# EasyEDA Pro project AiSortArduino.eprj

# Schematic CaseSorter

## Sheets
1 Power
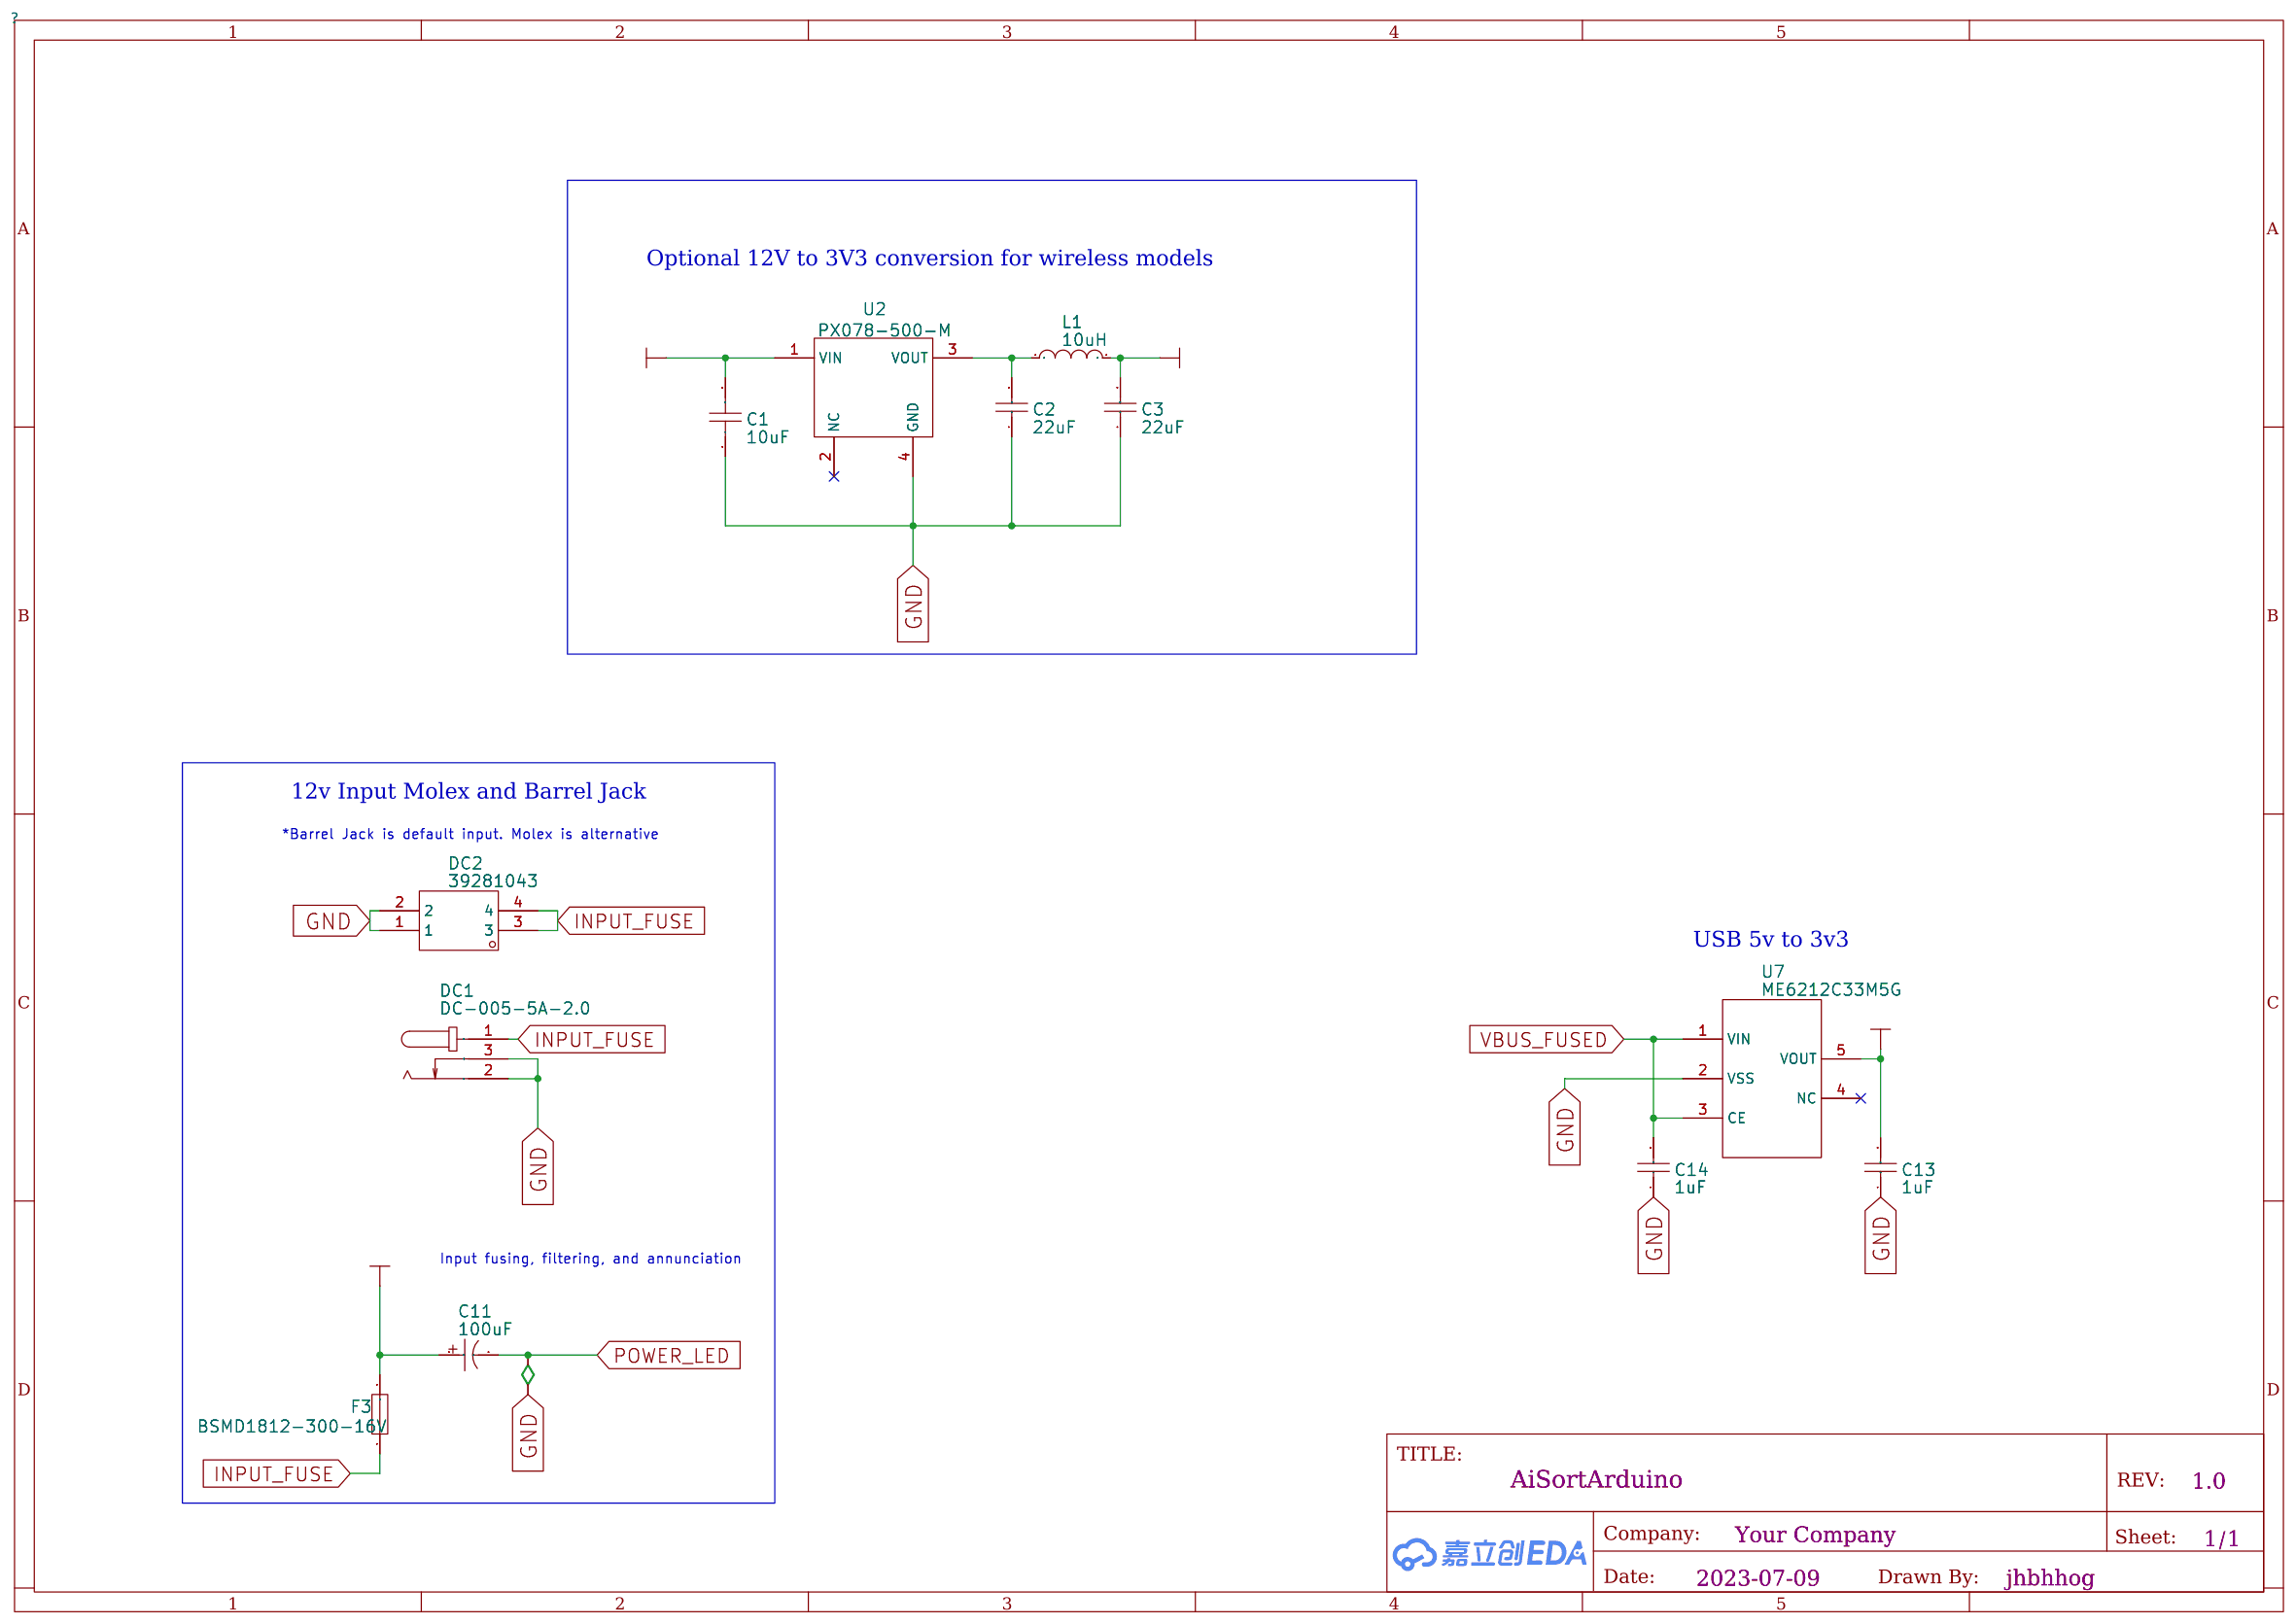
[diagram p0: Power]
2 Motor
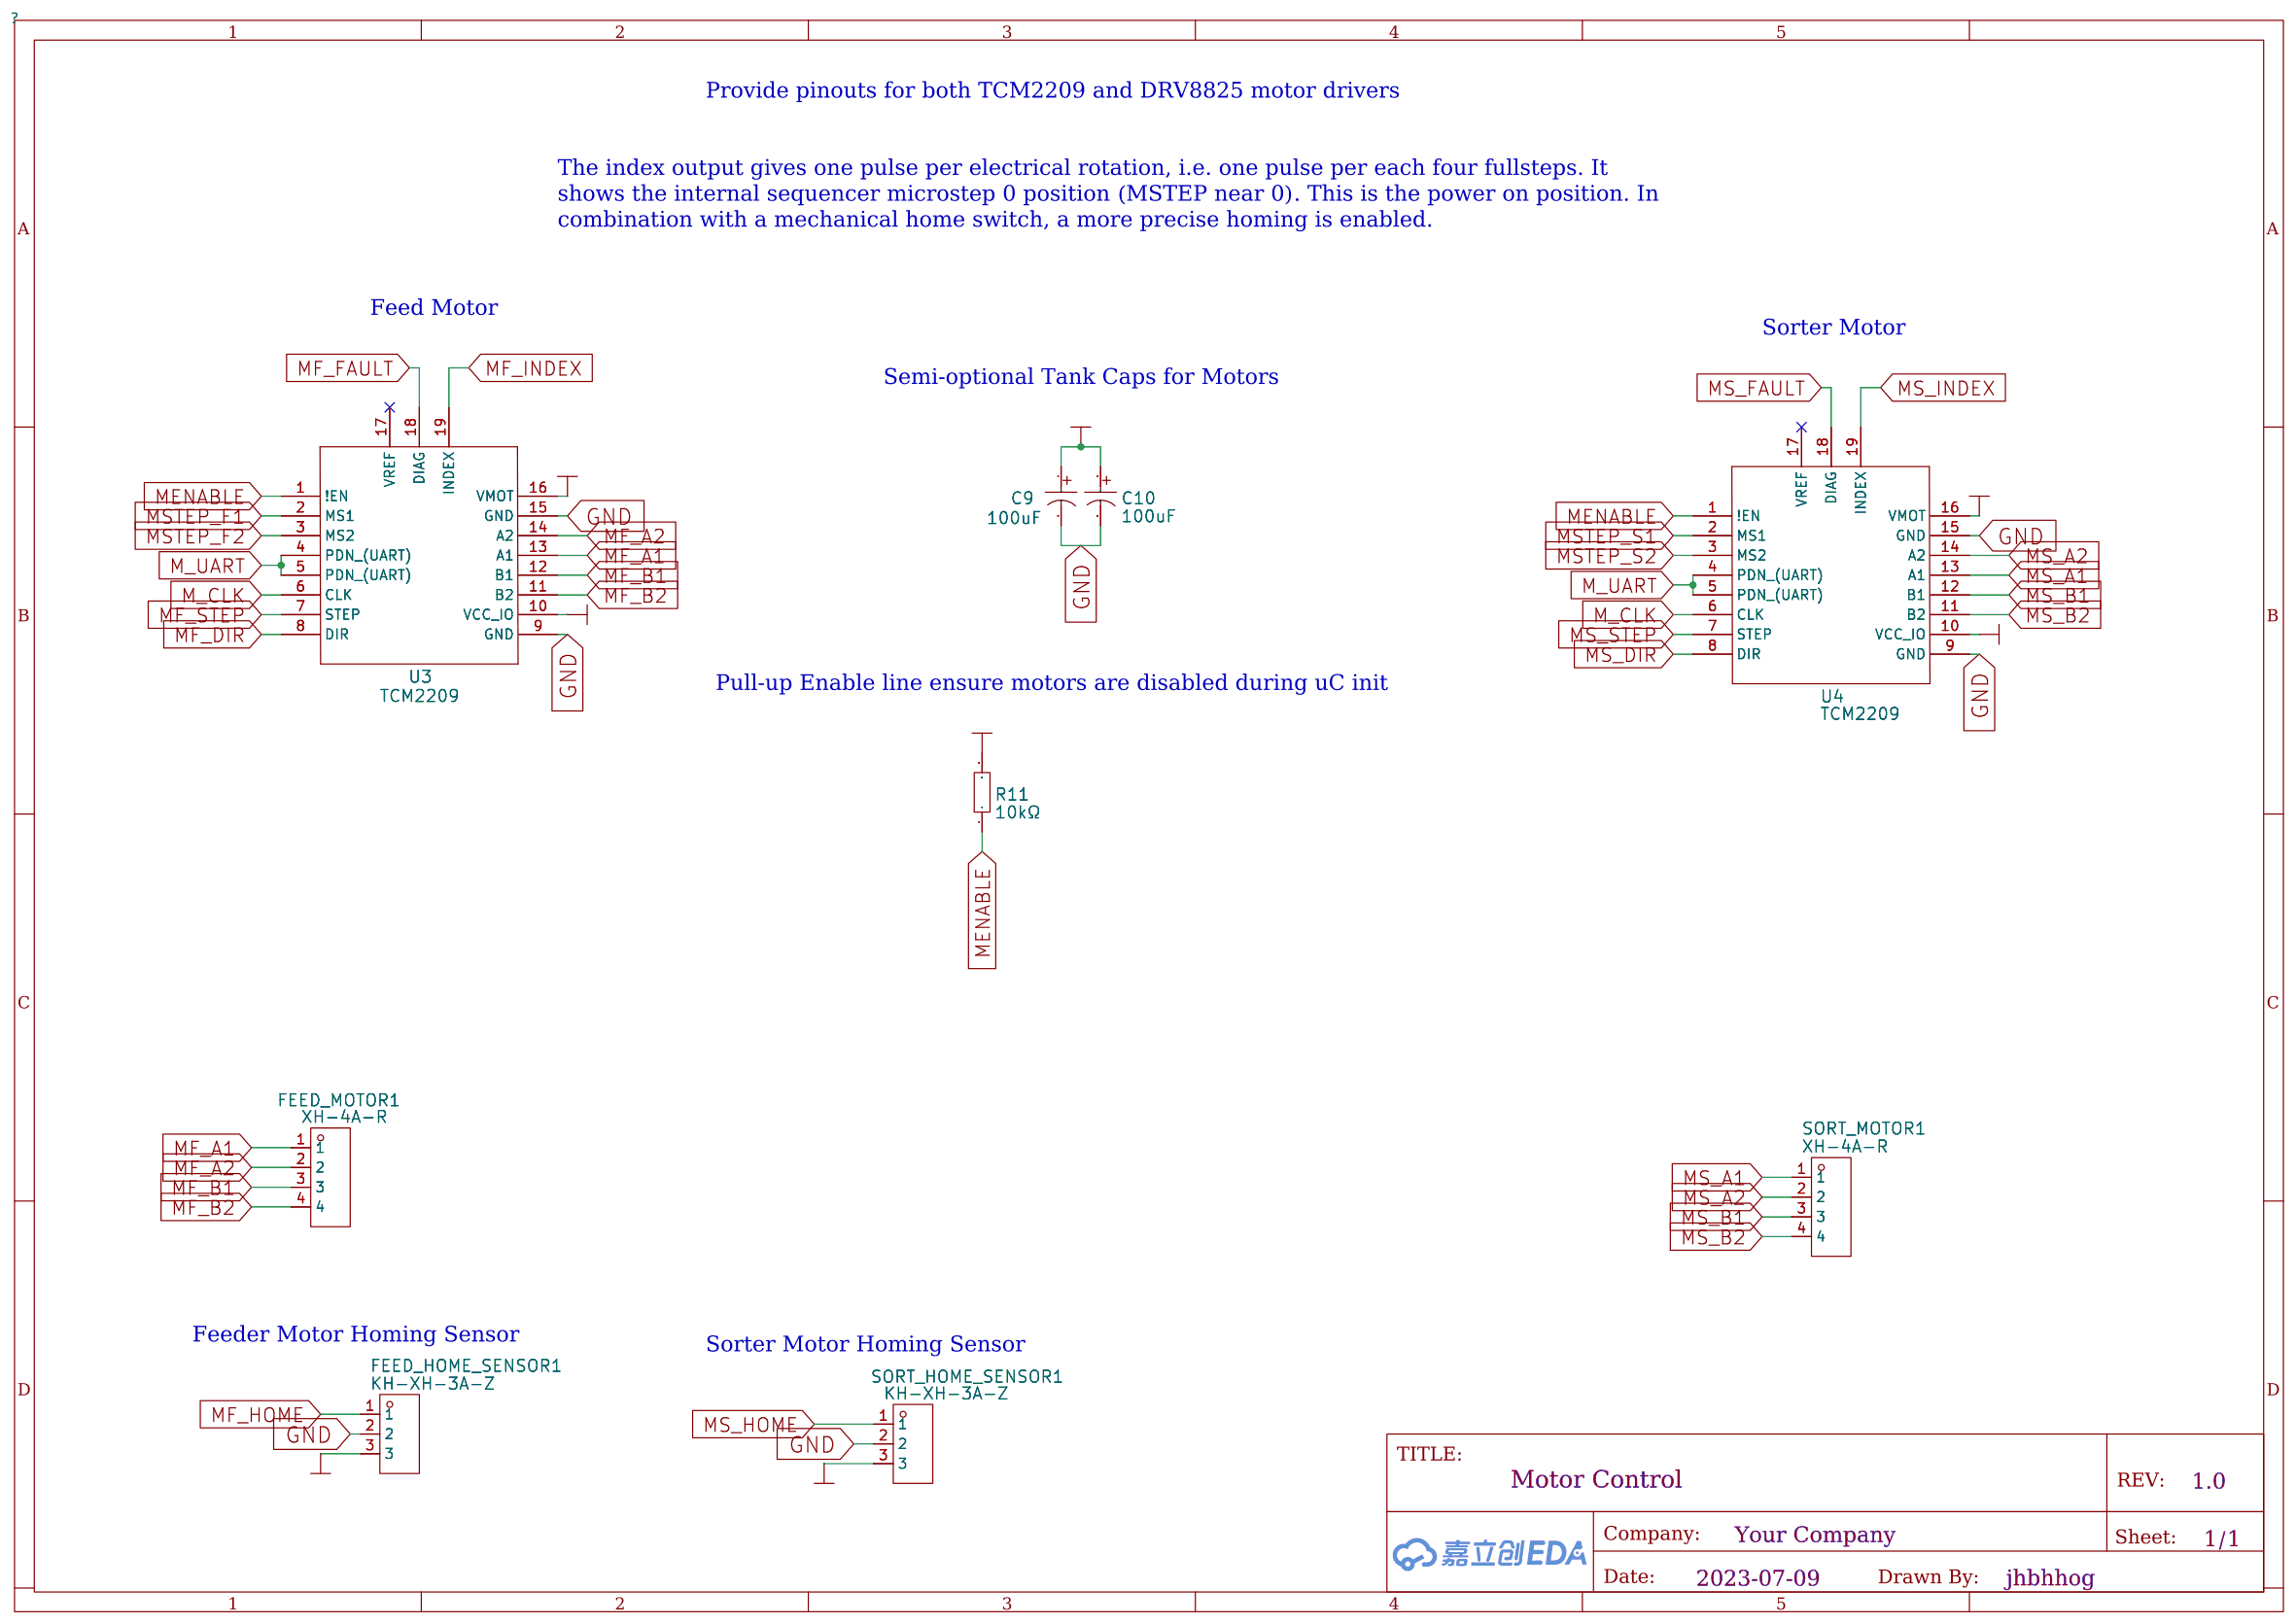
[diagram p1: Motor]
3 IO
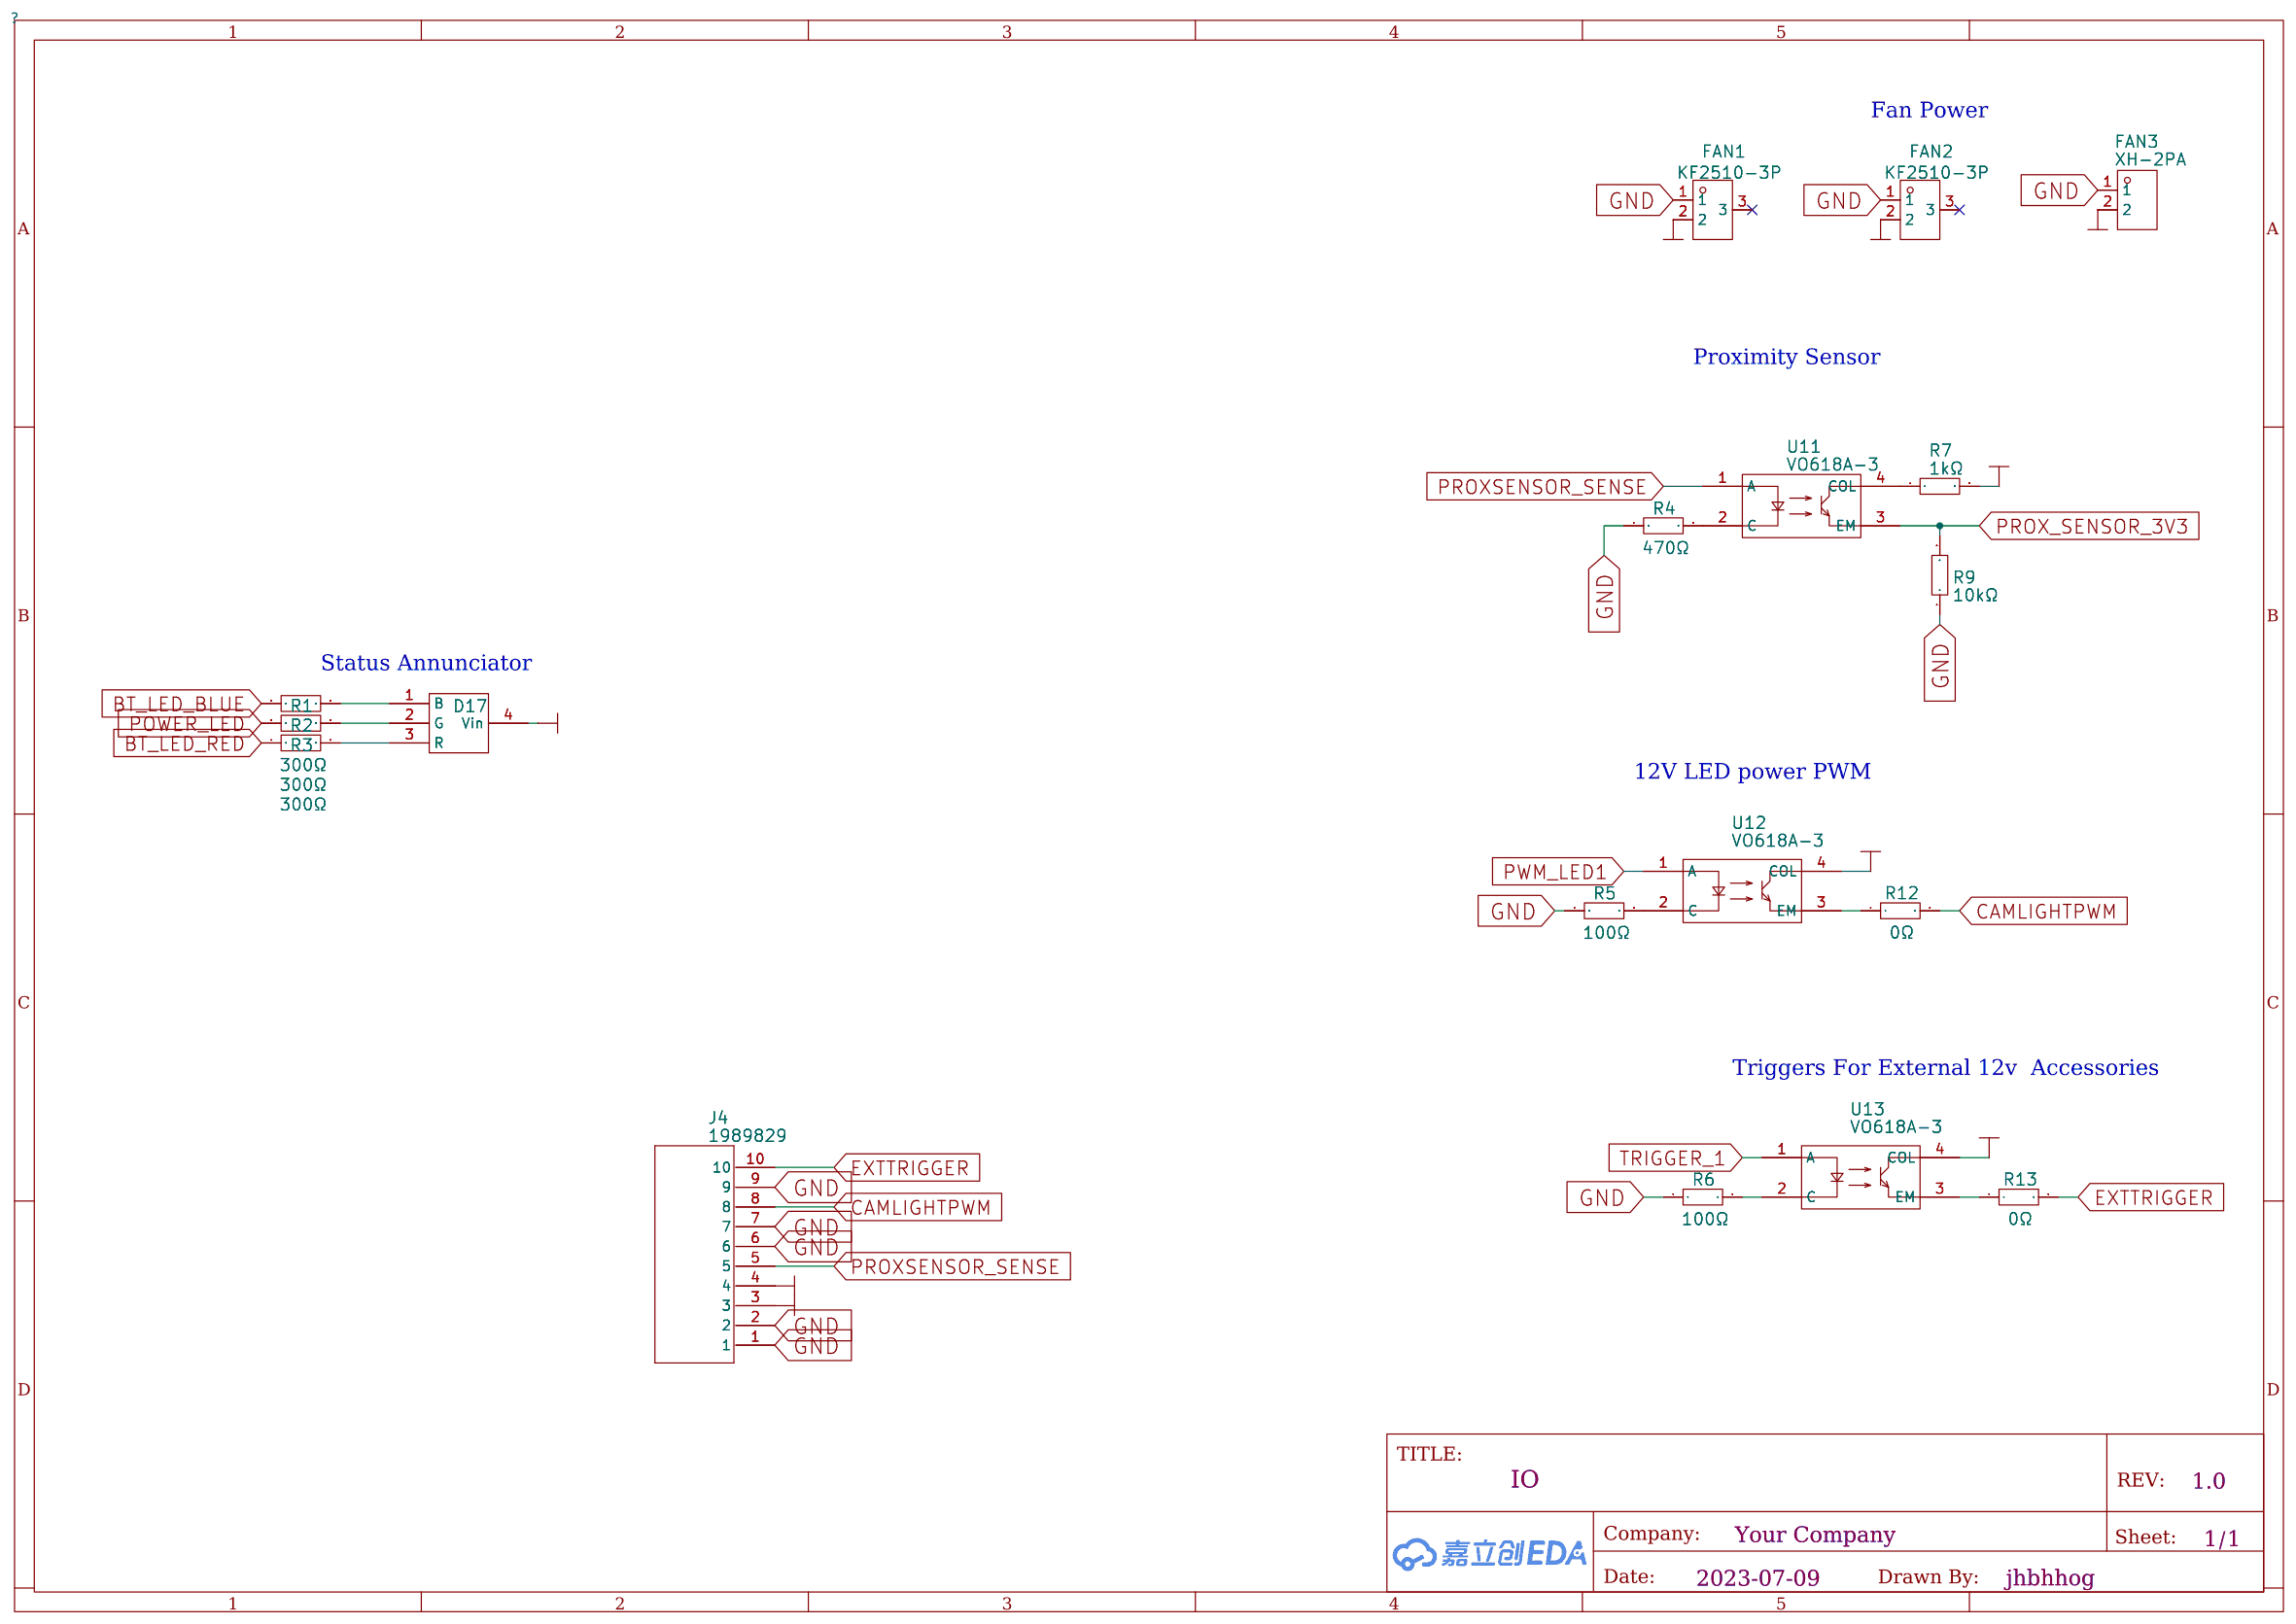
[diagram p2: IO]
4 ATMEGA
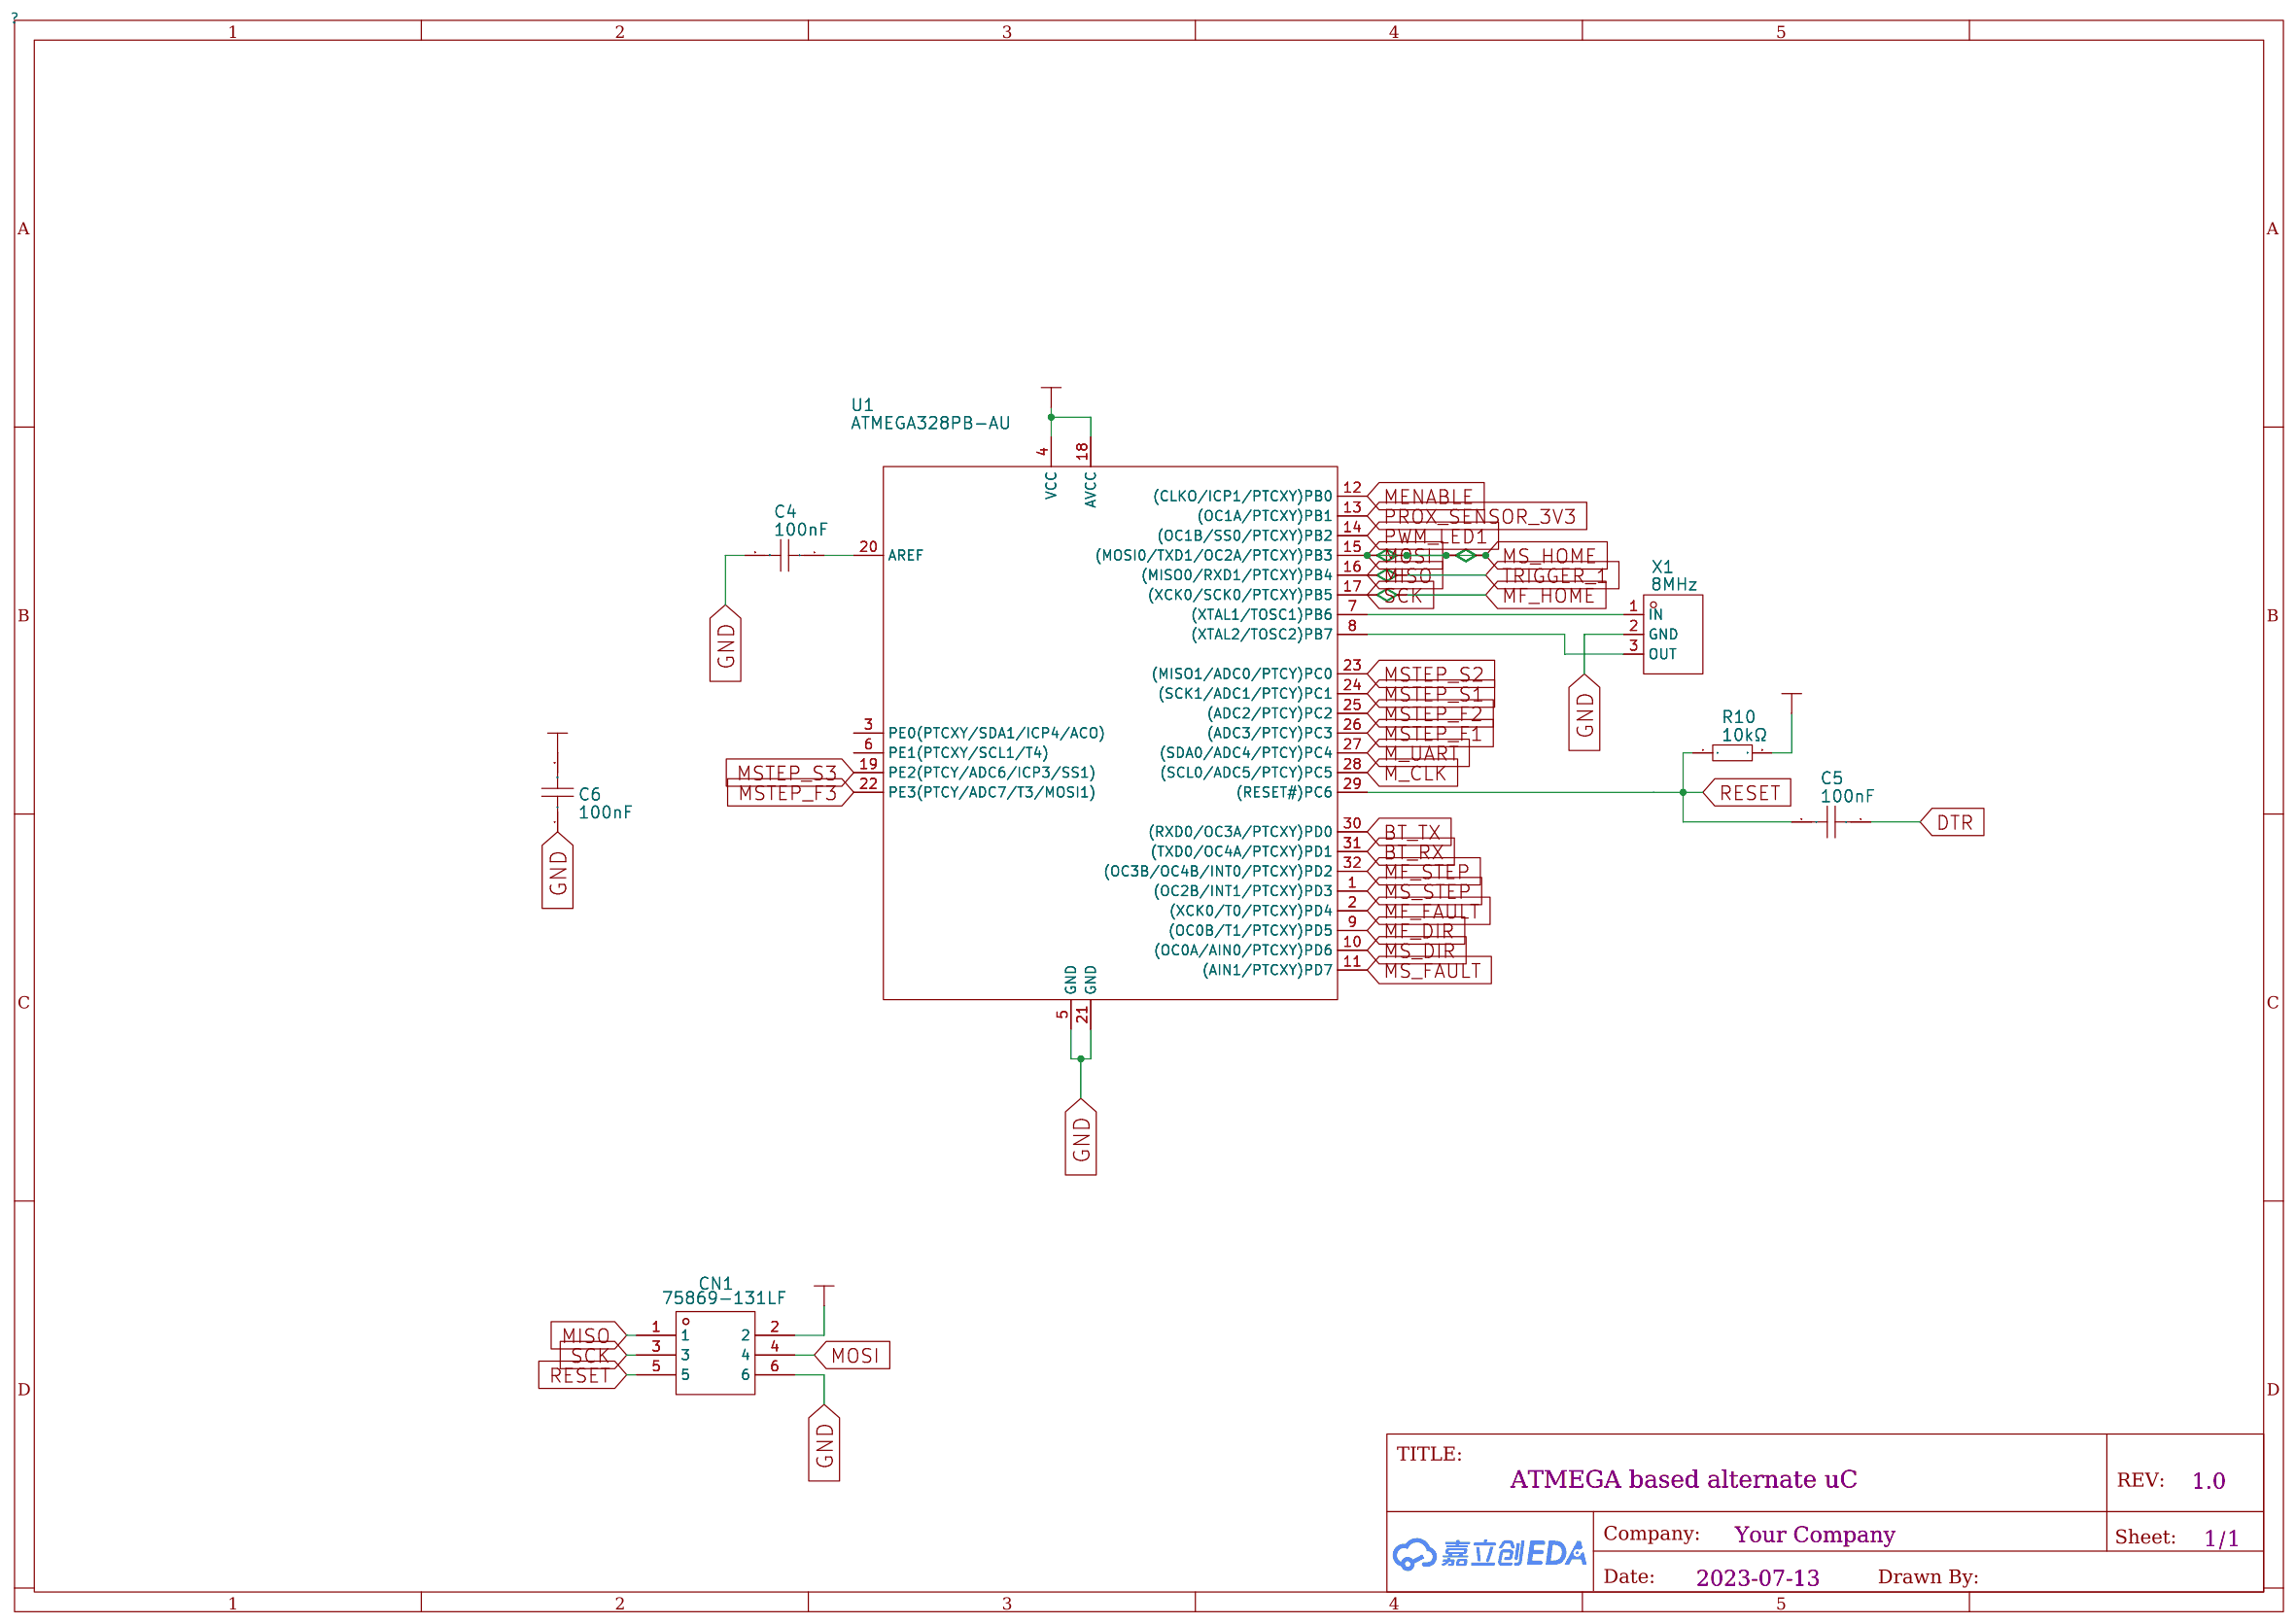
[diagram p3: ATMEGA]
5 Connectivity
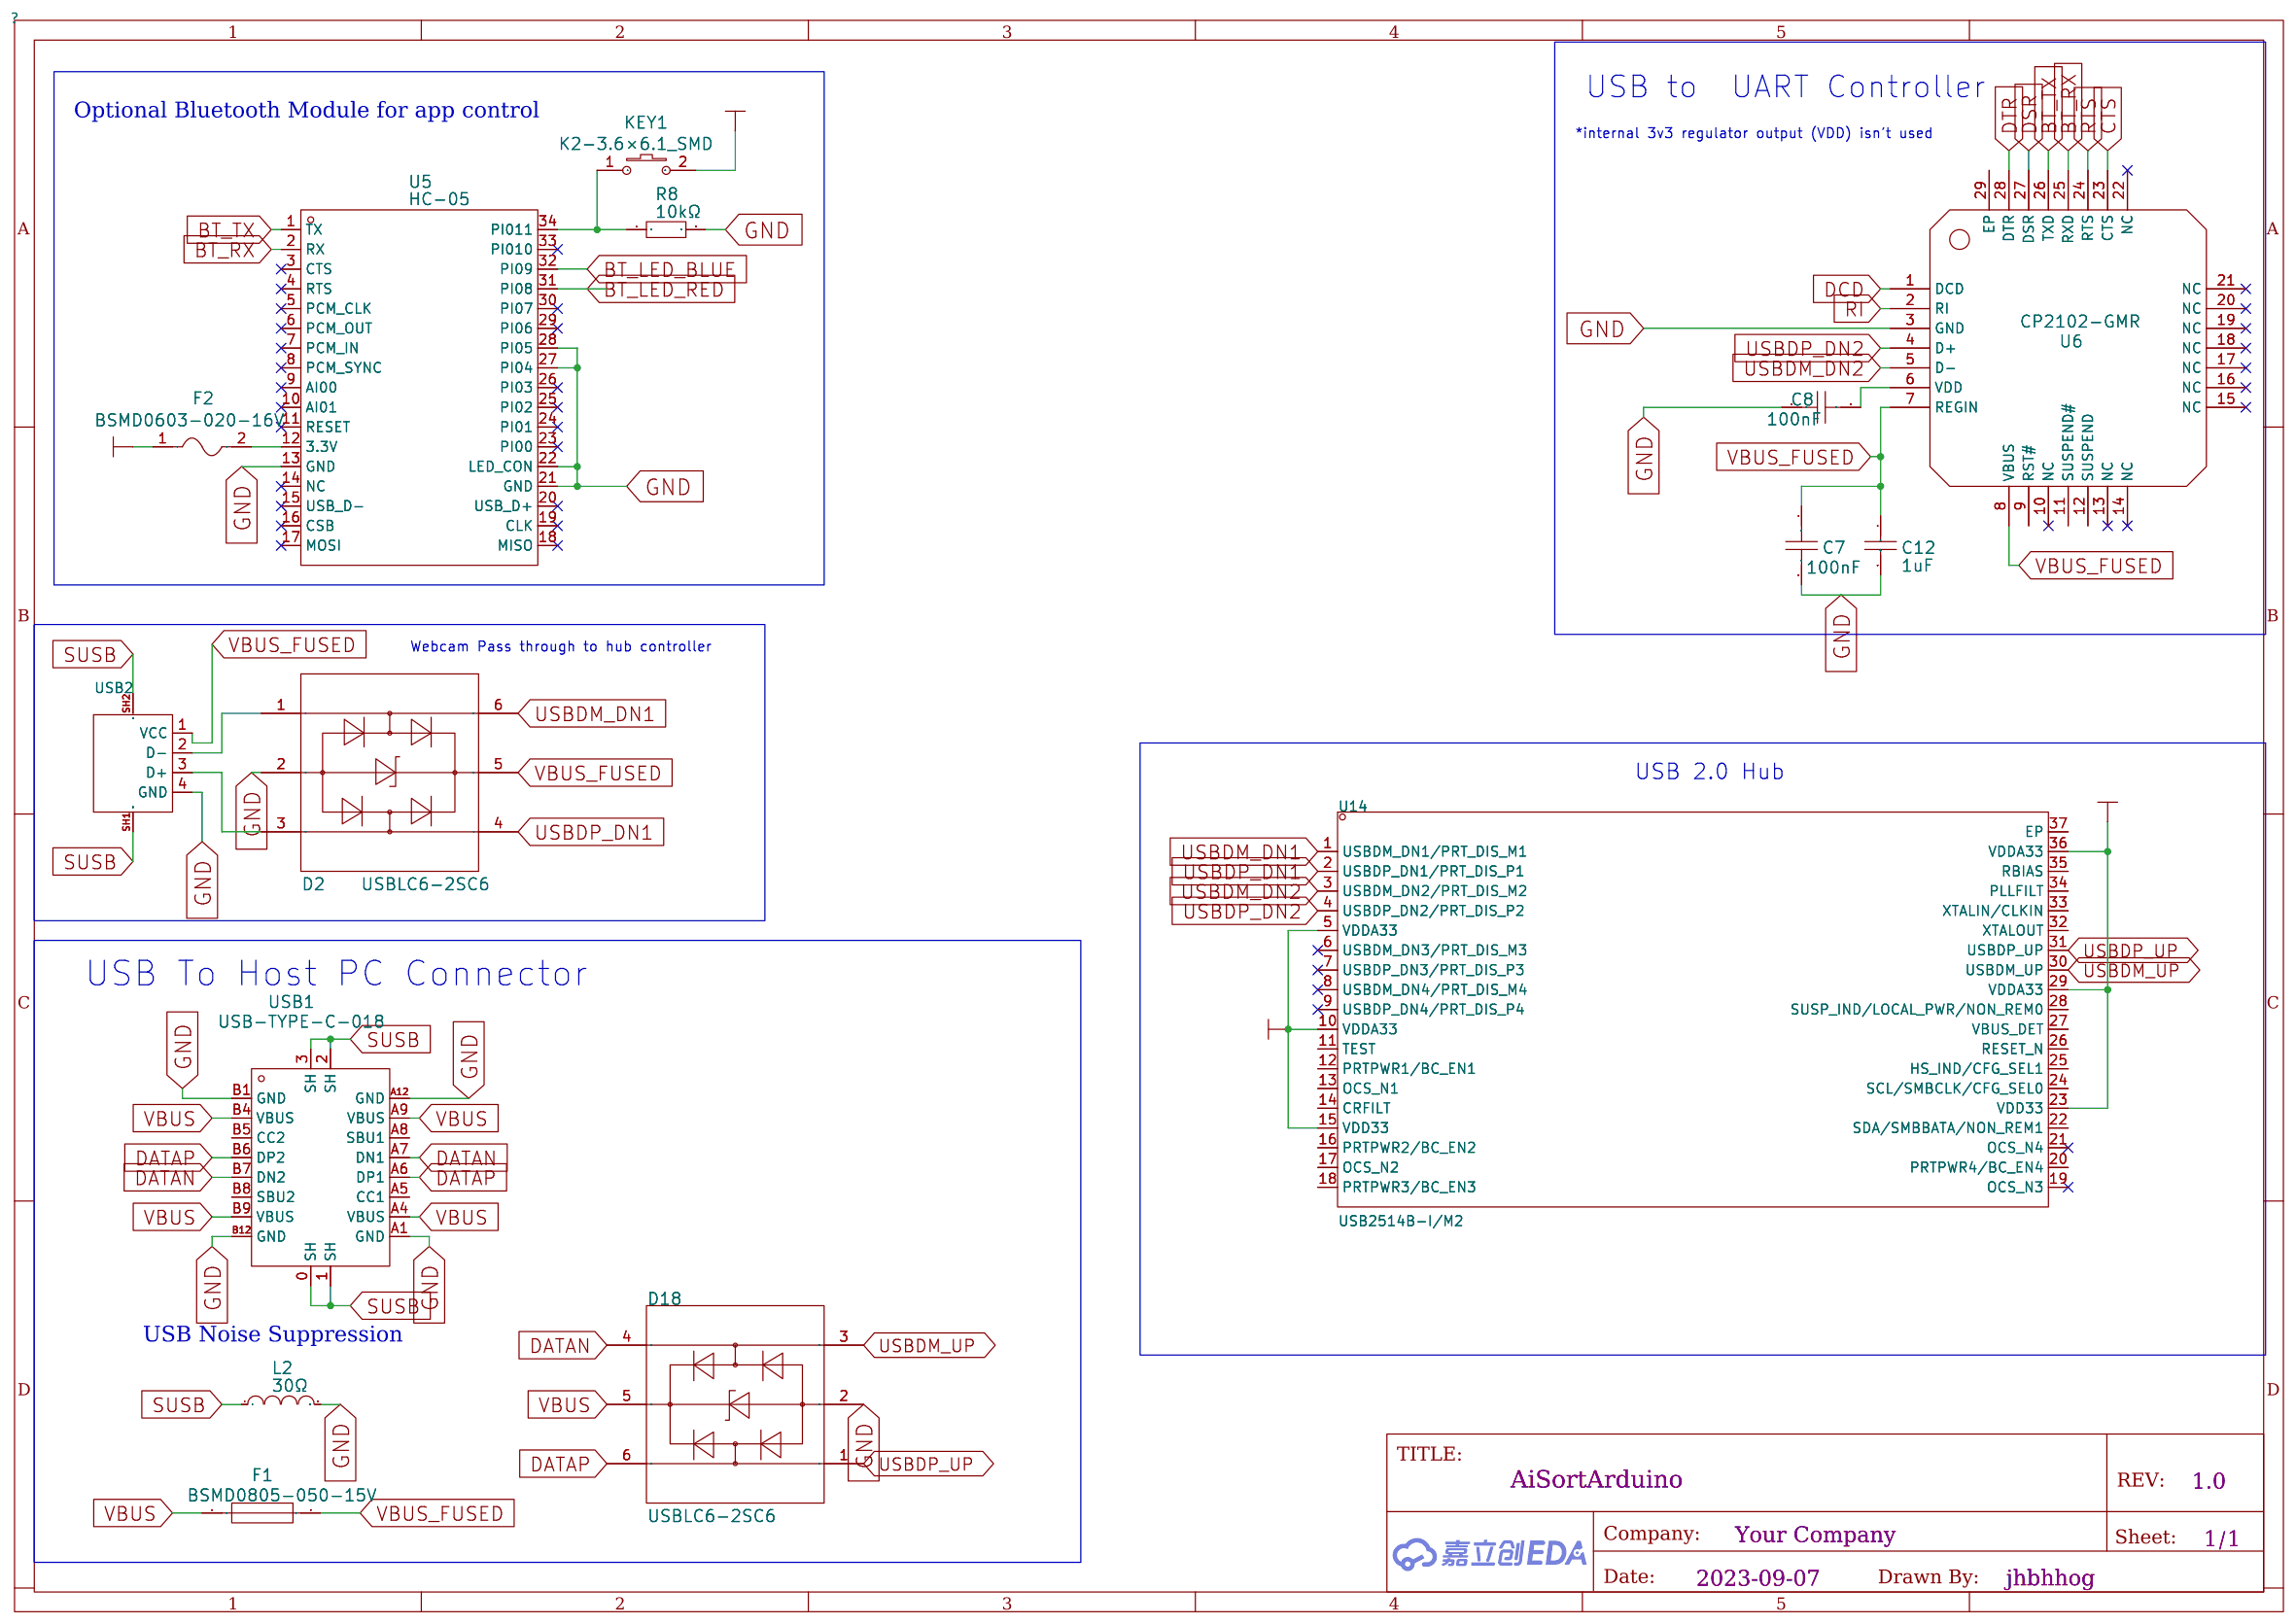
[diagram p4: Connectivity]

## Parts
sheet ATMEGA
C4  100nF  [C0402]
C5  100nF  [C0402]
C6  100nF  [C0402]
CN1  75869-131LF  [CONN-TH_6P-P2.54_75869-131LF]
R10  10kΩ  [R0603]
U1  ATMEGA328PB-AU  [TQFP-32_L7.0-W7.0-P0.80-LS9.0-BL]
X1  8MHz  [OSC-SMD_3P-L3.2-W1.3-P1.20]
sheet Connectivity
C7  100nF  [C0402]
C8  100nF  [C0402]
C12  1uF  [C0603]
D2  USBLC6-2SC6  [SOT-23-6_L2.9-W1.6-P0.95-LS2.8-BL]
D18  USBLC6-2SC6  [SOT-23-6_L2.9-W1.6-P0.95-LS2.8-BL]
F1  BSMD0805-050-15V  [F0805]
F2  BSMD0603-020-16V  [F0603]
KEY1  K2-3.6×6.1_SMD  [KEY-SMD_2P-L6.2-W3.6-LS8.0]
L2  30Ω  [L0805]
R8  10kΩ  [R0603]
U5  HC-05  [BULETM-SMD_HC-05]
U6  CP2102-GMR  [WQFN-28_L5.0-W5.0-P0.50-BL-EP3.2]
U14  USB2514B-I/M2  [SQFN-36_L6.0-W6.0-P0.50-BL-EP]
USB1  USB-TYPE-C-018  [USB-C_SMD-TYPE-C-31-M-12]
USB2  902-131A1011D10100  [USB-A-TH__USB-AF-90]
sheet IO
D17  UHD1110-FKA  [UHD1110-FKA: RGB SMD LED]
FAN1  KF2510-3P  [CONN-TH_3P-P2.54_338006293]
FAN2  KF2510-3P  [CONN-TH_3P-P2.54_338006293]
FAN3  XH-2PA  [CONN-TH_XH-2A]
J4  1989829  [1989829]
R1  300Ω  [R0603]
R2  300Ω  [R0603]
R3  300Ω  [R0603]
R4  470Ω  [R0603]
R5  100Ω  [R0603]
R6  100Ω  [R0603]
R7  1kΩ  [R0603]
R9  10kΩ  [R0603]
R12  0Ω  [R0603]
R13  0Ω  [R0603]
U11  VO618A-3  [DIP-4_L6.4-W4.6-P2.54-LS7.6-BL]
U12  VO618A-3  [DIP-4_L6.4-W4.6-P2.54-LS7.6-BL]
U13  VO618A-3  [DIP-4_L6.4-W4.6-P2.54-LS7.6-BL]
sheet Motor
C9  100uF  [CAP-SMD_BD6.3-L6.6-W6.6-FD]
C10  100uF  [CAP-SMD_BD6.3-L6.6-W6.6-FD]
FEED_HOME_SENSOR1  KH-XH-3A-Z  [CONN-TH_KH-XH-3A-Z]
FEED_MOTOR1  XH-4A-R  [CONN-TH_XH-4A-RED]
R11  10kΩ  [R0603]
SORT_HOME_SENSOR1  KH-XH-3A-Z  [CONN-TH_KH-XH-3A-Z]
SORT_MOTOR1  XH-4A-R  [CONN-TH_XH-4A-RED]
U3  TCM2209  [TCM2209]
U4  TCM2209  [TCM2209]
sheet Power
C1  10uF  [C0603]
C2  22uF  [C1210]
C3  22uF  [C1210]
C11  100uF  [CAP-SMD_BD6.3-L6.6-W6.6-FD]
C13  1uF  [C0603]
C14  1uF  [C0603]
DC1  DC-005-5A-2.0  [DC-IN-TH_DC-005-5A-2.0]
DC2  39281043  [CONN-TH_39281043]
F3  BSMD1812-300-16V  [F1812]
L1  10uH  [IND-SMD_L2.5-W2.0_MHCD252012B-2R2M-A8L]
U2  PX078-500-M  [PX078-500-M_FOOTPRINT]
U7  ME6212C33M5G  [SOT-23-5_L3.0-W1.7-P0.95-LS2.8-BL]

## Library data of the parts
C4-C8 = 100nF: Supplier: LCSC; Supplier Part: C344189; Manufacturer: CCTC(三环); Manufacturer Part: TCC0402X5R104K160AT; JLCPCB Part Class: Extended Part
CN1 = 75869-131LF: Supplier: LCSC; Supplier Part: C168680; Manufacturer: Amphenol; JLCPCB Part Class: Extended Part
R8-R11 = 10kΩ: Supplier: LCSC; Manufacturer: YAGEO(国巨); Manufacturer Part: RC0603FR-0710KL; Supplier Part: C98220; JLCPCB Part Class: Extended Part
U1 = ATMEGA328PB-AU: Supplier: LCSC; Manufacturer: MICROCHIP(美国微芯); Supplier Part: C132230; JLCPCB Part Class: Extended Part
X1 = 8MHz: Supplier: LCSC; Supplier Part: C907975; Manufacturer: muRata(村田); Manufacturer Part: CSTNE8M00G520000R0; JLCPCB Part Class: Extended Part
C12-C14 = 1uF: Supplier: LCSC; Manufacturer Part: CL10A105KO8NNNC; Manufacturer: SAMSUNG(三星); Supplier Part: C1592; JLCPCB Part Class: Extended Part
D2 D18 = USBLC6-2SC6: Supplier: LCSC; Manufacturer: ST(意法半导体); Supplier Part: C7519; JLCPCB Part Class: Extended Part
F1 = BSMD0805-050-15V: Supplier: LCSC; Supplier Part: C883109; Manufacturer: BHFUSE(佰宏); JLCPCB Part Class: Extended Part
F2 = BSMD0603-020-16V: Supplier: LCSC; Supplier Part: C883092; Manufacturer: BHFUSE(佰宏); JLCPCB Part Class: Extended Part
KEY1 = K2-1107ST-A4SW-06: Supplier Part: C118141; Supplier: LCSC; 制造商: 韩国韩荣
L2 = 30Ω: Supplier: LCSC; Manufacturer: muRata(村田); Manufacturer Part: BLM21PG300SN1D; Supplier Part: C16903; JLCPCB Part Class: Extended Part
U5 = HC-05: Supplier: LCSC; Supplier Part: C9900001063; Manufacturer: null; JLCPCB Part Class: ExtendedPart
U6 = CP2102-GMR: Supplier: LCSC; Manufacturer: SILICON LABS(芯科); Supplier Part: C6568; JLCPCB Part Class: Basic Part
U14 = USB2514B-I/M2: Applications Function:集线器 Protocol:; LCSC Part Name: USB 2.0高速集线器控制器; Supplier Part: C220679; Manufacturer: MICROCHIP(美国微芯); Supplier Footprint: SQFN-36-EP(6x6); JLCPCB Part Class: Extended Part; Datasheet: https://atta.szlcsc.com/upload/public/pdf/source/20180613/C220679_5406C825D415F058D3466663F78F68E9.pdf; Supplier: LCSC; Applications Function: 集线器
USB1 = USB-TYPE-C-018: Supplier: LCSC; Supplier Part: C2927038; Manufacturer: DEALON(德艺隆); JLCPCB Part Class: Extended Part
USB2 = 902-131A1011D10100: Connector Type:Type-A Standard:USB 2.0 Gender:Female Number of Contacts:4 Number of Ports:1; LCSC Part Name: Type-A 母座; Supplier Part: C2345; Manufacturer: 精拓金; Supplier Footprint: 插件; JLCPCB Part Class: Extended Part; Supplier: LCSC; Connector Type: Type-A; Standard: USB 2.0; Gender: Female; Number of Contacts: 4; Number of Ports: 1
D17 = UHD1110-FKA-CL1A13r3q1BBQFMF3: Manufacturer: CreeLED; Supplier: Mouser; Supplier Part: 941-UHD0FKAC11BQFMF3
FAN1 FAN2 = KF2510-3P: Supplier: LCSC; Supplier Part: C9900009650; Manufacturer: null; link: https://atta.szlcsc.comnull; JLCPCB Part Class: ExtendedPart
FAN3 = XH-2PA: Supplier: LCSC; Supplier Part: C5258883; Manufacturer: ZHOURI(洲日); link: https://atta.szlcsc.com/upload/public/pdf/source/20221111/941C48A64A881023E1ECD9BB647261A0.pdf; JLCPCB Part Class: ExtendedPart
J4 = 1989829
R1-R3 = 300Ω: Supplier: LCSC; Manufacturer: UNI-ROYAL(厚声); Manufacturer Part: 0603WAJ0301T5E; Supplier Part: C25229; JLCPCB Part Class: Extended Part
R4 = 470Ω: Supplier: LCSC; Manufacturer: YAGEO(国巨); Manufacturer Part: RC0603FR-07470RL; Supplier Part: C114669; JLCPCB Part Class: Extended Part
R5 R6 = 100Ω: Supplier: LCSC; Manufacturer: YAGEO(国巨); Manufacturer Part: RC0603JR-07100RL; Supplier Part: C110091; JLCPCB Part Class: Extended Part
R7 = 1kΩ: Supplier: LCSC; Manufacturer Part: RC0603FR-071KL; Manufacturer: YAGEO(国巨); Supplier Part: C22548; JLCPCB Part Class: Extended Part
R12 R13 = 0Ω: Supplier: LCSC; Manufacturer: YAGEO(国巨); Manufacturer Part: RC0603JR-070RL; Supplier Part: C95177; JLCPCB Part Class: Extended Part
U11-U13 = VO618A-3: Supplier: LCSC; Manufacturer: VISHAY(威世); Supplier Part: C142630; JLCPCB Part Class: ExtendedPart
C9-C11 = 100uF: Supplier: LCSC; Manufacturer: Nichicon(尼吉康); Manufacturer Part: UCD1V101MCL6GS; Supplier Part: C134220; JLCPCB Part Class: Extended Part
FEED_HOME_SENSOR1 SORT_HOME_SENSOR1 = KH-XH-3A-Z: Supplier: LCSC; Supplier Part: C2761194; Manufacturer: kinghelm(金航标); JLCPCB Part Class: ExtendedPart
FEED_MOTOR1 SORT_MOTOR1 = XH-4A-R: Supplier: LCSC; Supplier Part: C2979568; Manufacturer: HCTL(华灿天禄); link: https://atta.szlcsc.com/upload/public/pdf/source/20220304/4BAAA5C0FD621E69CA65C70E50656FD3.pdf; JLCPCB Part Class: ExtendedPart
U3 U4 = TCM2209
C1 = 10uF: Supplier: LCSC; Manufacturer: SAMSUNG(三星); Manufacturer Part: CL10A106MA8NRNC; Supplier Part: C96446; JLCPCB Part Class: Basic Part
C2 C3 = GRM32ER71A226KE20L: Supplier: LCSC; Manufacturer: muRata(村田); Supplier Part: C97972; JLCPCB Part Class: ExtendedPart
DC1 = DC-005-5A-2.0: Supplier: LCSC; Supplier Part: C381116; Manufacturer: XKB Enterprise; JLCPCB Part Class: Extended Part
DC2 = 39281043: Supplier: LCSC; Supplier Part: C293502; Manufacturer: MOLEX; JLCPCB Part Class: Extended Part
F3 = BSMD1812-300-16V: Supplier: LCSC; Supplier Part: C883162; Manufacturer: BHFUSE(佰宏); JLCPCB Part Class: Extended Part
L1 = 10uH: Supplier: LCSC; Supplier Part: C703141; Manufacturer: muRata(村田); Manufacturer Part: DFE252012F-100M=P2; JLCPCB Part Class: Extended Part
U2 = PXO7803-500-M-TR: Manufacturer: CUIInc.; Supplier Part: 102-PXO7803-500-M-TRCT-ND; Supplier: Digi-Key
U7 = ME6212C33M5G: Supplier: LCSC; Manufacturer: MICRONE(南京微盟); Supplier Part: C81233; JLCPCB Part Class: Extended Part

## Nets
+12V: C1.2 C9.1 C10.1 C11.1 F3.2 FAN1.2 FAN2.2 FAN3.2 J4.3 J4.4 U2.1(VIN) U3.16(VMOT) U4.16(VMOT) U12.4(COL) U13.4(COL)
GND: C1.1 C2.1 C3.1 C4.2 C6.1 C7.2 C8.1 C9.2 C10.2 C11.2 C12.2 C13.1 C14.1 CN1.6 D2.2 D18.2 DC1.2 DC1.3 DC2.1 DC2.2 FAN1.1 FAN2.1 FAN3.1 FEED_HOME_SENSOR1.2 J4.1 J4.2 J4.6 J4.7 J4.9 L2.2 R2.1 R4.1 R5.1 R6.1 R8.2 R9.1 SORT_HOME_SENSOR1.2 U1.5(GND) U1.21(GND) U2.4(GND) U3.9(GND) U3.15(GND) U4.9(GND) U4.15(GND) U5.13(GND) U5.21(GND) U5.22(LED_CON) U5.27(PI04) U5.28(PI05) U6.3(GND) U7.2(VSS) USB1.A1(GND) USB1.A12(GND) USB1.B1(GND) USB1.B12(GND) USB2.4(GND) X1.2(GND)
VBUS: D18.5 F1.1 USB1.A4(VBUS) USB1.A9(VBUS) USB1.B4(VBUS) USB1.B9(VBUS)
VBUS_FUSED: C7.1 C12.1 C14.2 D2.5 F1.2 U6.7(REGIN) U6.8(VBUS) U7.1(VIN) U7.3(CE) USB2.1(VCC)
VCC: C3.2 C6.2 C13.2 CN1.2 D17.4(Vin) F2.1 FEED_HOME_SENSOR1.3 KEY1.2 L1.2 R7.2 R10.2 R11.2 SORT_HOME_SENSOR1.3 U1.4(VCC) U1.18(AVCC) U3.10(VCC_IO) U4.10(VCC_IO) U7.5(VOUT) U14.5(VDDA33) U14.10(VDDA33) U14.15(VDD33) U14.23(VDD33) U14.29(VDDA33) U14.36(VDDA33)
BT_LED_BLUE: R1.1 U5.32(PI09)
BT_LED_RED: R3.1 U5.31(PI08)
BT_RX: U1.31((TXD0/OC4A/PTCXY)PD1) U5.2(RX) U6.25(RXD)
BT_TX: U1.30((RXD0/OC3A/PTCXY)PD0) U5.1(TX) U6.26(TXD)
CAMLIGHTPWM: J4.8 R12.2
CTS: U6.23(CTS)
DATAN: D18.4 USB1.A7(DN1) USB1.B7(DN2)
DATAP: D18.6 USB1.A6(DP1) USB1.B6(DP2)
DCD: U6.1(DCD)
DSR: U6.27(DSR)
DTR: C5.1 U6.28(DTR)
EXTTRIGGER: J4.10 R13.2
INPUT_FUSE: DC1.1 DC2.3 DC2.4 F3.1
M_CLK: U1.28((SCL0/ADC5/PTCY)PC5) U3.6(CLK) U4.6(CLK)
M_UART: U1.27((SDA0/ADC4/PTCY)PC4) U3.4(PDN (UART)) U3.5(PDN (UART)) U4.4(PDN (UART)) U4.5(PDN (UART))
MENABLE: R11.1 U1.12((CLKO/ICP1/PTCXY)PB0) U3.1(!EN) U4.1(!EN)
MF_A1: FEED_MOTOR1.1 U3.13(A1)
MF_A2: FEED_MOTOR1.2 U3.14(A2)
MF_B1: FEED_MOTOR1.3 U3.12(B1)
MF_B2: FEED_MOTOR1.4 U3.11(B2)
MF_DIR: U1.9((OC0B/T1/PTCXY)PD5) U3.8(DIR)
MF_FAULT: U1.2((XCK0/T0/PTCXY)PD4) U3.18(DIAG)
MF_HOME: CN1.3 FEED_HOME_SENSOR1.1 U1.17((XCK0/SCK0/PTCXY)PB5)
MF_INDEX: U3.19(INDEX)
MF_STEP: U1.32((OC3B/OC4B/INT0/PTCXY)PD2) U3.7(STEP)
MISO: CN1.1 U1.16((MISO0/RXD1/PTCXY)PB4) U13.1(A)
MOSI: CN1.4 SORT_HOME_SENSOR1.1 U1.15((MOSI0/TXD1/OC2A/PTCXY)PB3)
MS_A1: SORT_MOTOR1.1 U4.13(A1)
MS_A2: SORT_MOTOR1.2 U4.14(A2)
MS_B1: SORT_MOTOR1.3 U4.12(B1)
MS_B2: SORT_MOTOR1.4 U4.11(B2)
MS_DIR: U1.10((OC0A/AIN0/PTCXY)PD6) U4.8(DIR)
MS_FAULT: U1.11((AIN1/PTCXY)PD7) U4.18(DIAG)
MS_INDEX: U4.19(INDEX)
MS_STEP: U1.1((OC2B/INT1/PTCXY)PD3) U4.7(STEP)
MSTEP_F1: U1.26((ADC3/PTCY)PC3) U3.2(MS1)
MSTEP_F2: U1.25((ADC2/PTCY)PC2) U3.3(MS2)
MSTEP_F3: U1.22(PE3(PTCY/ADC7/T3/MOSI1))
MSTEP_S1: U1.24((SCK1/ADC1/PTCY)PC1) U4.2(MS1)
MSTEP_S2: U1.23((MISO1/ADC0/PTCY)PC0) U4.3(MS2)
MSTEP_S3: U1.19(PE2(PTCY/ADC6/ICP3/SS1))
PROX_SENSOR_3V3: R9.2 U1.13((OC1A/PTCXY)PB1) U11.3(EM)
PROXSENSOR_SENSE: J4.5 U11.1(A)
PWM_LED1: U1.14((OC1B/SS0/PTCXY)PB2) U12.1(A)
RESET: C5.2 CN1.5 R10.1 U1.29((RESET#)PC6)
RI: U6.2(RI)
RTS: U6.24(RTS)
SUSB: L2.1 USB1.0(SH) USB1.1(SH) USB1.2(SH) USB1.3(SH) USB2.SH1 USB2.SH2
USBDM_DN1: D2.6 U14.1(USBDM_DN1/PRT_DIS_M1)
USBDM_DN2: U6.5(D-) U14.3(USBDM_DN2/PRT_DIS_M2)
USBDM_UP: D18.3 U14.30(USBDM_UP)
USBDP_DN1: D2.4 U14.2(USBDP_DN1/PRT_DIS_P1)
USBDP_DN2: U6.4(D+) U14.4(USBDP_DN2/PRT_DIS_P2)
USBDP_UP: D18.1 U14.31(USBDP_UP)
$1N47: C2.2 L1.1 U2.3(VOUT)
$3N131: R12.1 U12.3(EM)
$3N136: R13.1 U13.3(EM)
$3N162: R6.2 U13.2(C)
$3N287: D17.1(B) R1.2
$3N288: D17.2(G) R2.2
$3N289: D17.3(R) R3.2
$3N418: R4.2 U11.2(C)
$3N419: R7.1 U11.4(COL)
$3N420: R5.2 U12.2(C)
$4N154: U1.7((XTAL1/TOSC1)PB6) X1.1(IN)
$4N155: U1.8((XTAL2/TOSC2)PB7) X1.3(OUT)
$4N166: C4.1 U1.20(AREF)
$5N56: KEY1.1 R8.1 U5.34(PI011)
$5N379: F2.2 U5.12(3.3V)
$5N440: C8.2 U6.6(VDD)
$5N3814: D2.1 USB2.2(D-)
$5N3819: D2.3 USB2.3(D+)

Not connected (* = marked no-connect by the designer): FAN1 3*; FAN2 3*; U1 3(PE0(PTCXY/SDA1/ICP4/ACO)) 6(PE1(PTCXY/SCL1/T4)); U2 2(NC)*; U3 17(VREF)*; U4 17(VREF)*; U5 3(CTS)* 4(RTS)* 5(PCM_CLK)* 6(PCM_OUT)* 7(PCM_IN)* 8(PCM_SYNC)* 9(AI00)* 10(AI01)* 11(RESET)* 14(NC)* 15(USB_D-)* 16(CSB)* 17(MOSI)* 18(MISO)* 19(CLK)* 20(USB_D+)* 23(PI00)* 24(PI01)* 25(PI02)* 26(PI03)* 29(PI06)* 30(PI07)* 33(PI010)*; U6 9(RST#) 10(NC)* 11(SUSPEND#) 12(SUSPEND) 13(NC)* 14(NC)* 15(NC)* 16(NC)* 17(NC)* 18(NC)* 19(NC)* 20(NC)* 21(NC)* 22(NC)* 29(EP); U7 4(NC)*; U14 6(USBDM_DN3/PRT_DIS_M3)* 7(USBDP_DN3/PRT_DIS_P3)* 8(USBDM_DN4/PRT_DIS_M4)* 9(USBDP_DN4/PRT_DIS_P4)* 11(TEST) 12(PRTPWR1/BC_EN1) 13(OCS_N1) 14(CRFILT) 16(PRTPWR2/BC_EN2) 17(OCS_N2) 18(PRTPWR3/BC_EN3) 19(OCS_N3)* 20(PRTPWR4/BC_EN4) 21(OCS_N4)* 22(SDA/SMBBATA/NON_REM1) 24(SCL/SMBCLK/CFG_SEL0) 25(HS_IND/CFG_SEL1) 26(RESET_N) 27(VBUS_DET) 28(SUSP_IND/LOCAL_PWR/NON_REM0) 32(XTALOUT) 33(XTALIN/CLKIN) 34(PLLFILT) 35(RBIAS) 37(EP); USB1 A5(CC1) A8(SBU1) B5(CC2) B8(SBU2)

## Notes on the sheets
sheet 1
- Optional 12V to 3V3 conversion for wireless models
- 12v Input Molex and Barrel Jack
- *Barrel Jack is default input. Molex is alternative
- USB 5v to 3v3
- Input fusing, filtering, and annunciation
sheet 2
- Provide pinouts for both TCM2209 and DRV8825 motor drivers
- The index output gives one pulse per electrical rotation, i.e. one pulse per each four fullsteps. It
  shows the internal sequencer microstep 0 position (MSTEP near 0). This is the power on position. In
  combination with a mechanical home switch, a more precise homing is enabled.
- Feed Motor
- Sorter Motor
- Semi-optional Tank Caps for Motors
- Pull-up Enable line ensure motors are disabled during uC init
- Feeder Motor Homing Sensor
- Sorter Motor Homing Sensor
sheet 3
- Fan Power
- Proximity Sensor
- Status Annunciator
- 12V LED power PWM
- Triggers For External 12v  Accessories
sheet 5
- USB to  UART Controller
- Optional Bluetooth Module for app control
- *internal 3v3 regulator output (VDD) isn't used
- Webcam Pass through to hub controller
- USB 2.0 Hub
- USB To Host PC Connector
- USB Noise Suppression

# Board PCB_AiSortArduino_80x
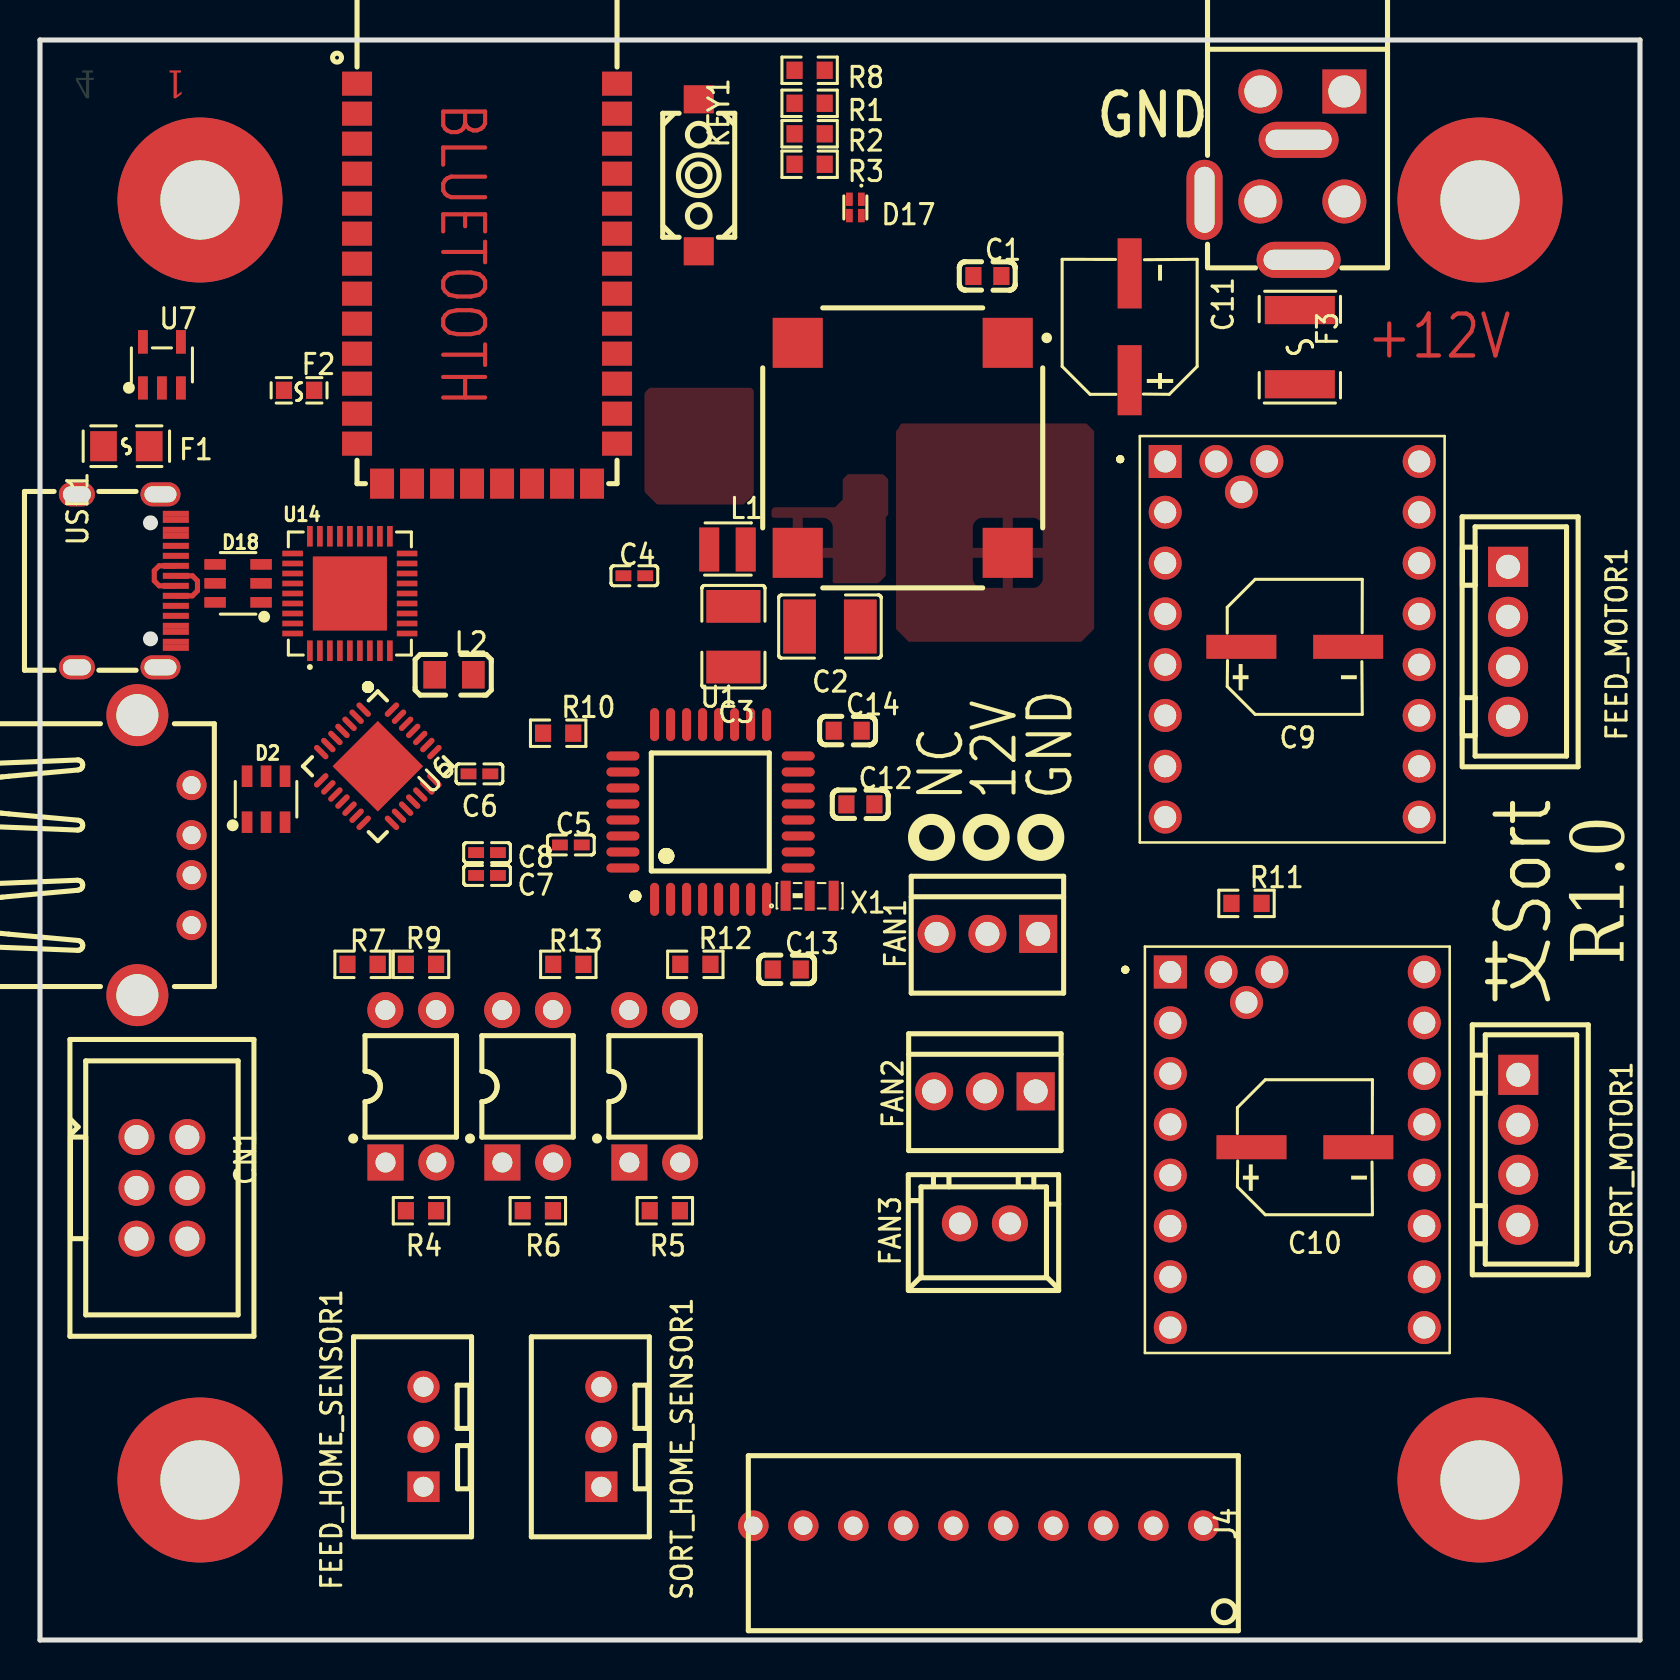
[diagram p5: board, top side]
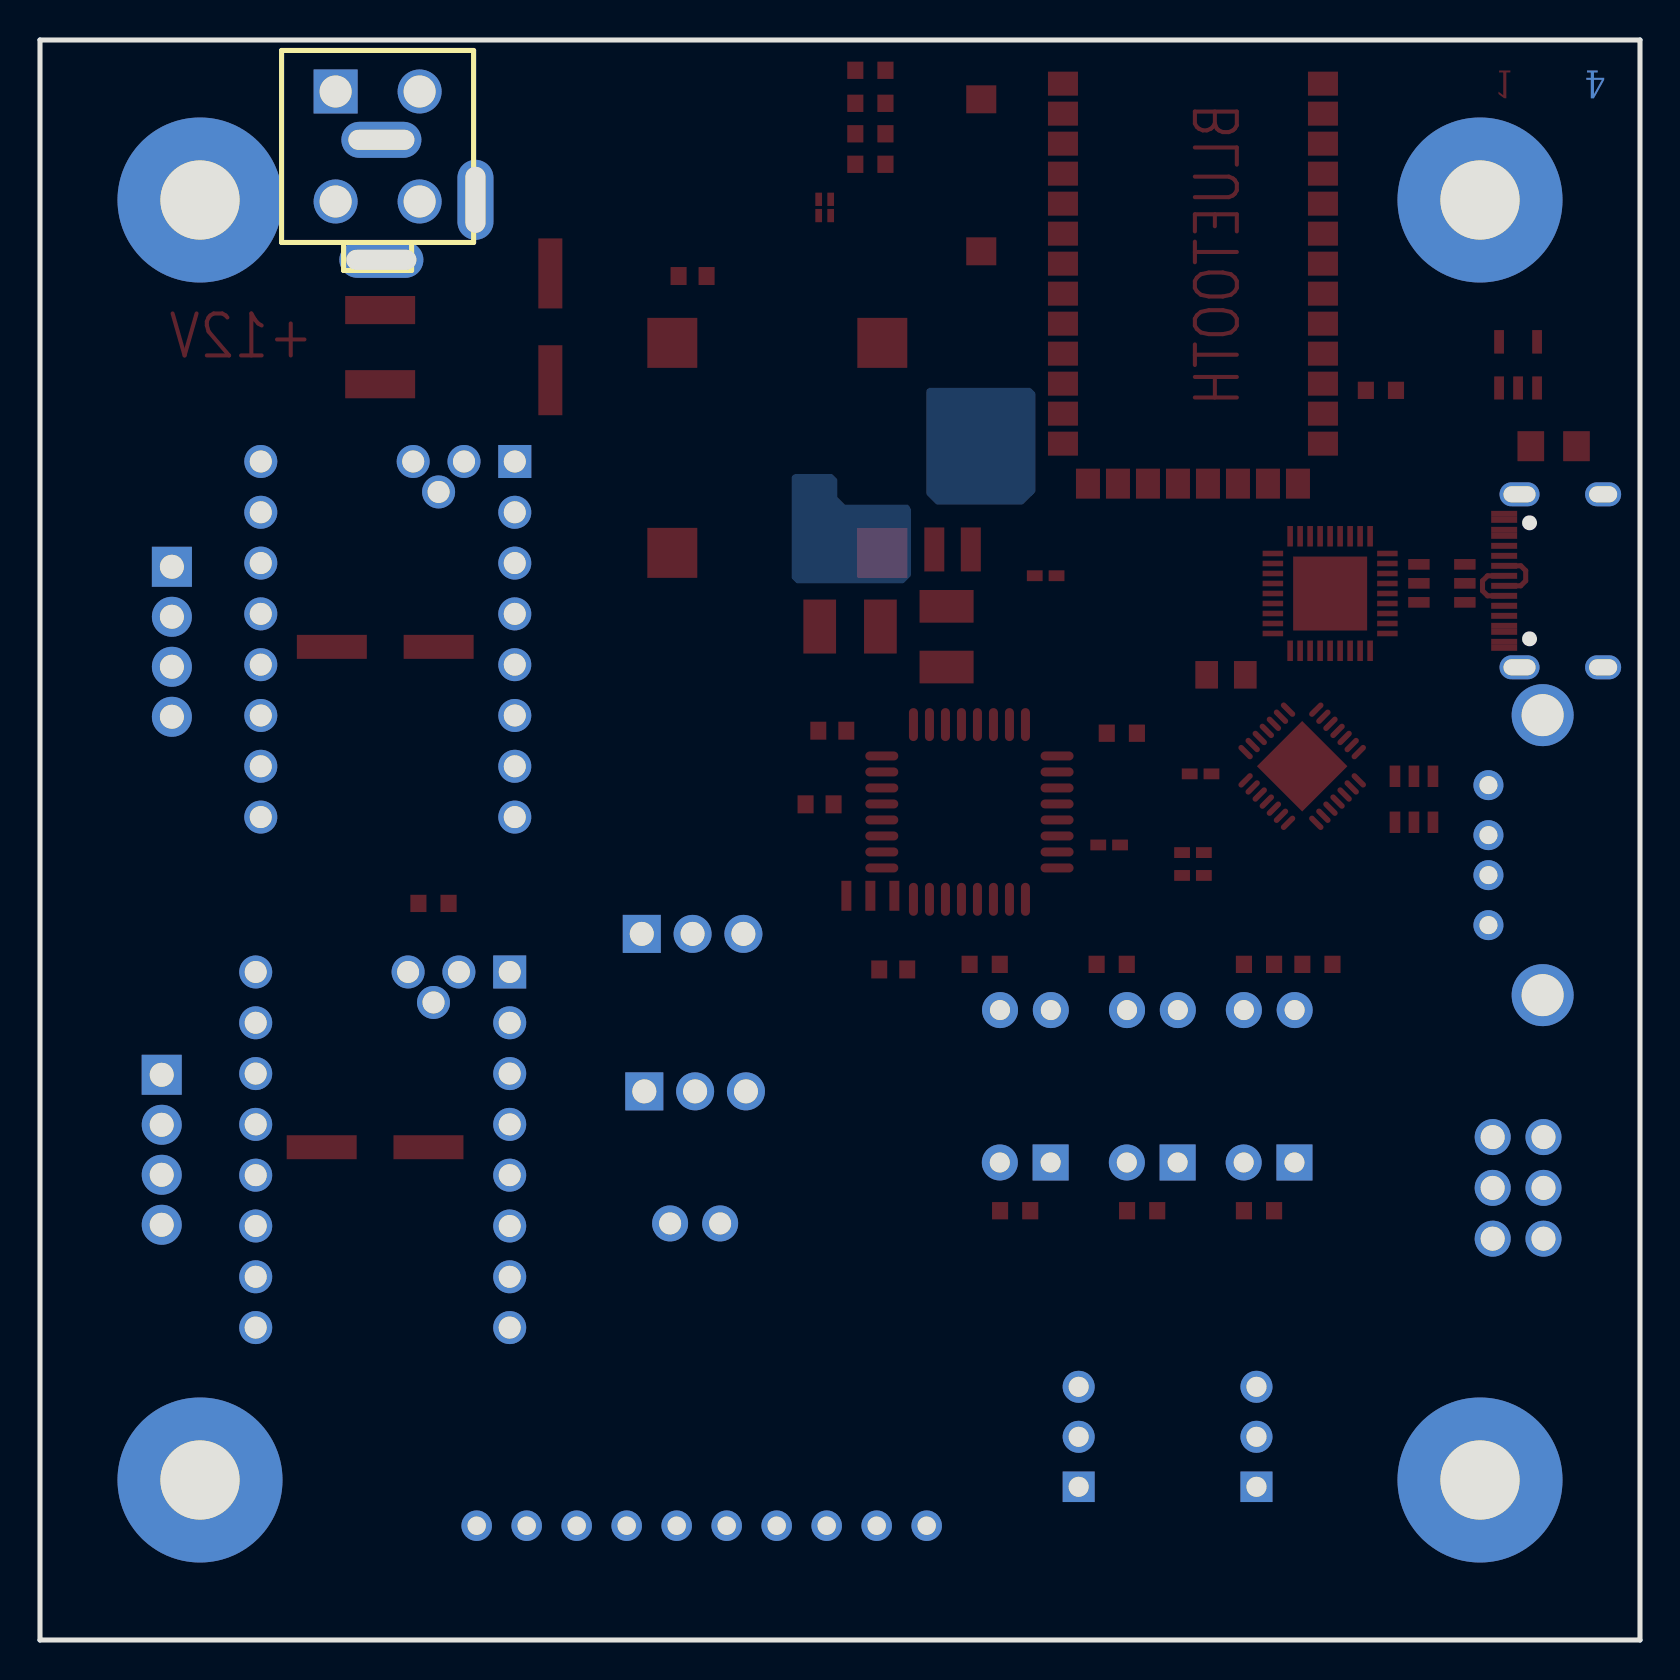
[diagram p6: board, bottom side, seen from below]

Outline 80 x 80 mm; copper layers: Top Layer, Inner1, Inner2, Bottom Layer. Coordinates in mm from the lower left corner of the outline.
Outline path: 0,80 80,80 80,0 0,0 0,80
Stack: Top Layer 0.035mm / Dielectric1 0.48mm PP er 4.5 / Inner1 0.035mm / Dielectric2 0.48mm FR4 er 4.5 / Inner2 0.035mm / Dielectric3 0.48mm PP er 4.5 / Bottom Layer 0.035mm

## Design rules (mm)
net DATAP: DP1
net DATAN: DP1
spacing Default (default): track to track 0.152, other pairs 0 to 0.152
spacing power: track to track 0.152, other pairs 0 to 0.152
track width Default (default): min 0.254, default 0.254, max 25.4
track width power: min 2, default 2, max 25.4
differential pair differentialPair (default): width min 0.127, default 0.254, max 2.54; gap min 0.152, default 0.152
via Default (default): diameter min 0.61, default 0.61, max 100.025; hole min 0.305, default 0.305, max 59.995
via power: diameter min 2.1, default 2.1, max 100.025; hole min 1.4, default 1.4, max 59.995
net +12V uses power
net U2_3 uses gge57255
net VCC uses gge57393
net GND uses gge56732
pour e4 uses gge57342
pour e11 uses gge56732
pour e12 uses gge57255
pour e13 uses gge57393

## Placement (name value [footprint] x y rotation side)
C1  10uF  [C0603]  47.37 68.2 0 top
C2  22uF  [C1210]  39.5 50.67 180 top
C3  22uF  [C1210]  34.67 50.17 90 top
C4  100nF  [C0402]  29.72 53.21 0 top
C5  100nF  [C0402]  26.54 39.75 0 top
C6  100nF  [C0402]  21.97 43.31 180 top
C7  100nF  [C0402]  22.35 38.23 0 top
C8  100nF  [C0402]  22.35 39.37 0 top
C9  100uF  [CAP-SMD_BD6.3-L6.6-W6.6-FD]  62.74 49.66 0 top
C10  100uF  [CAP-SMD_BD6.3-L6.6-W6.6-FD]  63.25 24.64 0 top
C11  100uF  [CAP-SMD_BD6.3-L6.6-W6.6-FD]  54.48 65.66 90 top
C12  1uF  [C0603]  41.02 41.78 0 top
C13  1uF  [C0603]  37.34 33.53 0 top
C14  1uF  [C0603]  40.39 45.47 0 top
CN1  75869-131LF  [CONN-TH_6P-P2.54_75869-131LF]  6.1 22.61 270 top
D2  USBLC6-2SC6  [SOT-23-6_L2.9-W1.6-P0.95-LS2.8-BL]  11.3 42.04 0 top
D17  UHD1110-FKA  [UHD1110-FKA: RGB SMD LED]  40.77 71.63 270 top
D18  USBLC6-2SC6  [SOT-23-6_L2.9-W1.6-P0.95-LS2.8-BL]  9.91 52.83 90 top
DC1  DC-005-5A-2.0  [DC-IN-TH_DC-005-5A-2.0]  60.58 72.01 270 top
DC2  39281043  [CONN-TH_39281043]  63.12 74.68 180 bottom
F1  BSMD0805-050-15V  [F0805]  4.32 59.69 180 top
F2  BSMD0603-020-16V  [F0603]  12.95 62.48 0 top
F3  BSMD1812-300-16V  [F1812]  62.99 64.64 270 top
FAN1  KF2510-3P  [CONN-TH_3P-P2.54_338006293]  47.37 35.31 0 top
FAN2  KF2510-3P  [CONN-TH_3P-P2.54_338006293]  47.24 27.43 0 top
FAN3  XH-2PA  [CONN-TH_XH-2A]  47.24 20.83 180 top
FEED_HOME_SENSOR1  KH-XH-3A-Z  [CONN-TH_KH-XH-3A-Z]  19.18 10.16 90 top
FEED_MOTOR1  XH-4A-R  [CONN-TH_XH-4A-RED]  73.41 49.91 270 top
J4  -  [1989829]  58.17 5.72 270 top
KEY1  K2-3.6×6.1_SMD  [KEY-SMD_2P-L6.2-W3.6-LS8.0]  32.94 73.24 270 top
L1  10uH  [IND-SMD_L2.5-W2.0_MHCD252012B-2R2M-A8L]  34.37 54.53 0 top
L2  30Ω  [L0805]  20.7 48.26 0 top
NOREF  -  [Pad_e710]  72 72 0 top
NOREF#2  -  [Pad_e711]  72 8 0 top
NOREF#3  -  [Pad_e712]  8 8 0 top
NOREF#4  -  [Pad_e713]  8 72 0 top
R1  300Ω  [R0603]  38.48 76.83 0 top
R2  300Ω  [R0603]  38.48 75.31 0 top
R3  300Ω  [R0603]  38.48 73.79 0 top
R4  470Ω  [R0603]  19.05 21.46 0 top
R5  100Ω  [R0603]  31.24 21.46 0 top
R6  100Ω  [R0603]  24.89 21.46 0 top
R7  1kΩ  [R0603]  16.13 33.78 180 top
R8  10kΩ  [R0603]  38.48 78.49 0 top
R9  10kΩ  [R0603]  19.05 33.78 0 top
R10  10kΩ  [R0603]  25.91 45.34 0 top
R11  10kΩ  [R0603]  60.32 36.83 0 top
R12  0Ω  [R0603]  32.77 33.78 0 top
R13  0Ω  [R0603]  26.42 33.78 0 top
SORT_HOME_SENSOR1  KH-XH-3A-Z  [CONN-TH_KH-XH-3A-Z]  28.07 10.16 90 top
SORT_MOTOR1  XH-4A-R  [CONN-TH_XH-4A-RED]  73.91 24.51 270 top
U1  ATMEGA328PB-AU  [TQFP-32_L7.0-W7.0-P0.80-LS9.0-BL]  33.53 41.4 0 top
U2  PX078-500-M  [PX078-500-M_FOOTPRINT]  43.14 59.61 270 top
U3  -  [TCM2209]  62.61 50.04 0 top
U4  -  [TCM2209]  62.87 24.51 0 top
U5  HC-05  [BULETM-SMD_HC-05]  22.35 67.82 0 top
U6  CP2102-GMR  [WQFN-28_L5.0-W5.0-P0.50-BL-EP3.2]  16.89 43.69 225 top
U7  ME6212C33M5G  [SOT-23-5_L3.0-W1.7-P0.95-LS2.8-BL]  6.1 63.75 0 top
U11  VO618A-3  [DIP-4_L6.4-W4.6-P2.54-LS7.6-BL]  18.54 27.69 0 top
U12  VO618A-3  [DIP-4_L6.4-W4.6-P2.54-LS7.6-BL]  30.73 27.69 0 top
U13  VO618A-3  [DIP-4_L6.4-W4.6-P2.54-LS7.6-BL]  24.38 27.69 0 top
U14  USB2514B-I/M2  [SQFN-36_L6.0-W6.0-P0.50-BL-EP]  15.49 52.32 0 top
USB1  USB-TYPE-C-018  [USB-C_SMD-TYPE-C-31-M-12]  4.32 52.96 270 top
USB2  902-131A1011D10100  [USB-A-TH__USB-AF-90]  6.22 39.24 270 top
X1  8MHz  [OSC-SMD_3P-L3.2-W1.3-P1.20]  38.48 37.21 0 top

## Footprints (pads in the part's own frame, mm; a bottom-side part is the same pattern mirrored in y, then rotated)
1989829
  round 1.524 hole 0.914: 1(0,0) 2(0,-2.5) 3(0,-5) 4(0,-7.5) 5(0,-10) 6(0,-12.5) 7(0,-15) 8(0,-17.5) 9(0,-20) 10(0,-22.5)
BULETM-SMD_HC-05
  rect 1.5x1.2 smd: 1(-6.5,10) 2(-6.5,8.5) 3(-6.5,7) 4(-6.5,5.5) 5(-6.5,4) 6(-6.5,2.5) 7(-6.5,1) 8(-6.5,-0.5) 9(-6.5,-2) 10(-6.5,-3.5) 11(-6.5,-5) 12(-6.5,-6.5) 13(-6.5,-8) 22(6.5,-8) 23(6.5,-6.5) 24(6.5,-5) 25(6.5,-3.5) 26(6.5,-2) 27(6.5,-0.5) 28(6.5,1) 29(6.5,2.5) 30(6.5,4) 31(6.5,5.5) 32(6.5,7) 33(6.5,8.5) 34(6.5,10)
  rect 1.2x1.5 smd: 14(-5.25,-10) 15(-3.75,-10) 16(-2.25,-10) 17(-0.75,-10) 18(0.75,-10) 19(2.25,-10) 20(3.75,-10) 21(5.25,-10)
C0402
  rect 0.79x0.54 smd: 1(-0.545,0) 2(0.545,0)
C0603
  rect 0.8x0.9 smd: 1(-0.7,0) 2(0.7,0)
C1210
  rect 1.635x2.7 smd: 1(-1.518,0) 2(1.518,0)
CAP-SMD_BD6.3-L6.6-W6.6-FD
  rect 3.5x1.2 smd: 1(-2.67,0) 2(2.67,0)
CONN-TH_3P-P2.54_338006293
  rect 1.9x1.9 hole 1.2: 1(2.54,0)
  round 1.9 hole 1.2: 2(0,0) 3(-2.54,0)
CONN-TH_6P-P2.54_75869-131LF
  round 1.8 hole 1.2: 1(-2.54,-1.27) 2(-2.54,1.27) 3(0,-1.27) 4(0,1.27) 5(2.54,-1.27) 6(2.54,1.27)
CONN-TH_39281043
  rect 2.2x2.2 hole 1.6: 1(-2.1,2.75)
  round 2.2 hole 1.6: 2(2.1,2.75) 3(-2.1,-2.75) 4(2.1,-2.75)
CONN-TH_KH-XH-3A-Z
  rect 1.524x1.6 hole 1: 1(-2.5,0)
  round 1.6 hole 1: 2(0,0) 3(2.5,0)
CONN-TH_XH-2A
  round 1.8 hole 1.1: 1(-1.251,0) 2(1.251,0)
CONN-TH_XH-4A-RED
  rect 2x2 hole 1.2: 1(-3.75,0)
  round 2 hole 1.2: 2(-1.25,0) 3(1.25,0) 4(3.75,0)
DC-IN-TH_DC-005-5A-2.0
  oval 1.8x4.2 hole 1x3.5: 1(3,2.352)
  oval 1.8x4 hole 1x3.3: 2(-3,2.352)
  oval 4x1.8 hole 3.3x1: 3(-0.001,-2.352)
DIP-4_L6.4-W4.6-P2.54-LS7.6-BL
  rect 1.8x1.8 hole 1: 1(-1.265,-3.81)
  round 1.8 hole 1: 2(1.275,-3.81) 3(1.265,3.81) 4(-1.275,3.81)
F0603
  rect 0.806x0.864 smd: 1(-0.753,0) 2(0.753,0)
F0805
  rect 1.335x1.5 smd: 1(-1.143,0) 2(1.143,0)
F1812
  rect 1.407x3.499 smd: 1(-1.853,0) 2(1.853,0)
IND-SMD_L2.5-W2.0_MHCD252012B-2R2M-A8L
  rect 1x2.2 smd: 1(0.913,0) 2(-0.913,0)
KEY-SMD_2P-L6.2-W3.6-LS8.0
  rect 1.4x1.5 smd: 1(-3.8,0) 2(3.8,0)
L0805
  rect 1.133x1.377 smd: 1(-0.966,0) 2(0.966,0)
OSC-SMD_3P-L3.2-W1.3-P1.20
  rect 0.5x1.5 smd: 1(-1.2,0) 2(0,0) 3(1.2,0)
Pad_e710
  round 8.25 hole 3.96: 1(0,0)
Pad_e711
  round 8.25 hole 3.96: 1(0,0)
Pad_e712
  round 8.25 hole 3.96: 1(0,0)
Pad_e713
  round 8.25 hole 3.96: 1(0,0)
PX078-500-M_FOOTPRINT
  rect 2.5x2.5 smd: 1(-5.25,5.25) 2(-5.25,-5.25) 3(5.25,-5.25) 4(5.25,5.25)
R0603
  rect 0.806x0.864 smd: 1(-0.753,0) 2(0.753,0)
SOT-23-5_L3.0-W1.7-P0.95-LS2.8-BL
  rect 0.49x1.157 smd: 1(-0.95,-1.153) 2(0,-1.153) 3(0.95,-1.153)
  rect 0.49x1.175 smd: 4(0.95,1.153) 5(-0.95,1.153)
SOT-23-6_L2.9-W1.6-P0.95-LS2.8-BL
  rect 0.532x1.072 smd: 1(-0.95,-1.149) 2(0,-1.149) 3(0.95,-1.149) 4(0.95,1.149) 5(0,1.149) 6(-0.95,1.149)
SQFN-36_L6.0-W6.0-P0.50-BL-EP
  rect 0.28x1.025 smd: 1(-2,-2.862) 2(-1.5,-2.862) 3(-1,-2.862) 4(-0.5,-2.862) 5(0,-2.862) 6(0.5,-2.862) 7(1,-2.862) 8(1.5,-2.862) 9(2,-2.862) 19(2,2.862) 20(1.5,2.862) 21(1,2.862) 22(0.5,2.862) 23(0,2.862) 24(-0.5,2.862) 25(-1,2.862) 26(-1.5,2.862) 27(-2,2.862)
  rect 1.025x0.28 smd: 10(2.862,-2) 11(2.862,-1.5) 12(2.862,-1) 13(2.862,-0.5) 14(2.862,0) 15(2.862,0.5) 16(2.862,1) 17(2.862,1.5) 18(2.862,2) 28(-2.862,2) 29(-2.862,1.5) 30(-2.862,1) 31(-2.862,0.5) 32(-2.862,0) 33(-2.862,-0.5) 34(-2.862,-1) 35(-2.862,-1.5) 36(-2.862,-2)
  rect 3.7x3.7 smd: 37(0,0)
TCM2209
  rect 1.65x1.65 hole 1.1: 1(-6.35,8.89)
  round 1.65 hole 1.1: 2(-6.35,6.35) 3(-6.35,3.81) 4(-6.35,1.27) 5(-6.35,-1.27) 6(-6.35,-3.81) 7(-6.35,-6.35) 8(-6.35,-8.89) 9(6.35,-8.89) 10(6.35,-6.35) 11(6.35,-3.81) 12(6.35,-1.27) 13(6.35,1.27) 14(6.35,3.81) 15(6.35,6.35) 16(6.35,8.89) 17(-3.81,8.89) 18(-1.27,8.89) 19(-2.54,7.366)
TQFP-32_L7.0-W7.0-P0.80-LS9.0-BL
  oval 0.45x1.65 smd: 1(-2.8,-4.369) 2(-2,-4.369) 3(-1.2,-4.369) 4(-0.4,-4.369) 5(0.4,-4.369) 6(1.2,-4.369) 7(2,-4.369) 8(2.8,-4.369) 17(2.8,4.369) 18(2,4.369) 19(1.2,4.369) 20(0.4,4.369) 21(-0.4,4.369) 22(-1.2,4.369) 23(-2,4.369) 24(-2.8,4.369)
  oval 1.65x0.45 smd: 9(4.381,-2.8) 10(4.381,-2) 11(4.381,-1.2) 12(4.381,-0.4) 13(4.381,0.4) 14(4.381,1.2) 15(4.381,2) 16(4.381,2.8) 25(-4.381,2.8) 26(-4.381,2) 27(-4.381,1.2) 28(-4.381,0.4) 29(-4.381,-0.4) 30(-4.381,-1.2) 31(-4.381,-2) 32(-4.381,-2.8)
UHD1110-FKA: RGB SMD LED
  rect 0.665x0.336 smd: 1(-0.407,0.3) 2(-0.407,-0.3) 3(0.407,-0.3) 4(0.407,0.3)
USB-A-TH__USB-AF-90
  round 1.5 hole 0.9: 1(-3.5,1.355) 2(-1,1.355) 3(1,1.355) 4(3.5,1.355)
  round 3.1 hole 2.1: SH1(7,-1.355) SH2(-7,-1.355)
USB-C_SMD-TYPE-C-31-M-12
  oval 1.2x2 hole 0.8x1.6: 0(-4.325,1.706) 1(4.325,1.706)
  oval 1.2x1.8 hole 0.8x1.4: 2(4.325,-2.474) 3(-4.325,-2.474)
  rect 0.3x1.3 smd: A1(-3.35,2.474) A4(-2.55,2.474) A5(-1.25,2.474) A6(-0.25,2.474) A7(0.25,2.474) A8(1.25,2.474) A9(2.55,2.474) A12(3.35,2.474) B1(3.05,2.474) B4(2.25,2.474) B5(1.75,2.474) B6(0.75,2.474) B7(-0.75,2.474) B8(-1.75,2.474) B9(-2.25,2.474) B12(-3.05,2.474)
WQFN-28_L5.0-W5.0-P0.50-BL-EP3.2
  oval 0.28x0.9 smd: 1(-1.501,-2.5) 2(-1.001,-2.5) 3(-0.5,-2.5) 4(0,-2.5) 5(0.5,-2.5) 6(1.001,-2.5) 7(1.501,-2.5) 15(1.501,2.5) 16(1.001,2.5) 17(0.5,2.5) 18(0,2.5) 19(-0.5,2.5) 20(-1.001,2.5) 21(-1.501,2.5)
  oval 0.9x0.28 smd: 8(2.5,-1.502) 9(2.5,-1.001) 10(2.5,-0.5) 11(2.5,-0.001) 12(2.5,0.5) 13(2.5,1) 14(2.5,1.501) 22(-2.5,1.501) 23(-2.5,1) 24(-2.5,0.5) 25(-2.5,-0.001) 26(-2.5,-0.5) 27(-2.5,-1.001) 28(-2.5,-1.502)
  rect 3.2x3.2 smd: 29(0,-0.001)

## Nets
As in the schematic, except:
GND: C1.1 C2.1 C3.1 C4.2 C6.1 C7.2 C8.1 C9.2 C10.2 C11.2 C12.2 C13.1 C14.1 CN1.6 D2.2 D18.2 DC1.2 DC1.3 DC2.1 DC2.2 FAN1.1 FAN2.1 FAN3.1 FEED_HOME_SENSOR1.2 J4.1 J4.2 J4.6 J4.7 J4.9 L2.2 NOREF.1 NOREF#2.1 NOREF#3.1 NOREF#4.1 R2.1 R4.1 R5.1 R6.1 R8.2 R9.1 SORT_HOME_SENSOR1.2 U1.5 U1.21 U2.4 U3.9 U3.15 U4.9 U4.15 U5.13 U5.21 U5.22 U5.27 U5.28 U6.3 U7.2 USB1.A1 USB1.A12 USB1.B1 USB1.B12 USB2.4 X1.2

Pads without a net: FAN1 3; FAN2 3; U1 3 6; U2 2; U3 17; U4 17; U5 3 4 5 6 7 8 9 10 11 14 15 16 17 18 19 20 23 24 25 26 29 30 33; U6 9 10 11 12 13 14 15 16 17 18 19 20 21 22 29; U7 4; U14 6 7 8 9 11 12 13 14 16 17 18 19 20 21 22 24 25 26 27 28 32 33 34 35 37; USB1 A5 A8 B5 B8

## Routing (per net, layer and track width the routed paths; a pad name or vN(x,y) marks a point on that pad's centre or on a via; arc(x,y) is an arc through that point)
DATAN: length 2.9
  Top Layer w0.254: USB1.A7 5.97,52.71 5.72,52.96 5.72,53.47 5.96,53.71 USB1.B7
DATAP: length 2.9
  Top Layer w0.254: USB1.A6 7.62,53.21 7.87,52.96 7.87,52.46 7.62,52.21 USB1.B6

## Copper pours and planes (outline as drawn; the poured copper is in the pictures)
GND on Top Layer: 43.05,60.83 52.32,60.83 52.71,60.45 52.71,50.55 52.07,49.91 43.43,49.91 42.8,50.55 42.8,60.45 42.93,60.58
VCC on Top Layer: 30.48,62.61 35.56,62.61 35.69,62.48 35.69,57.28 35.18,56.77 30.86,56.77 30.23,57.4 30.23,62.36
VCC on Bottom Layer: 30.48,62.61 35.56,62.61 35.69,62.48 35.69,57.28 35.18,56.77 30.86,56.77 30.23,57.4 30.23,62.36
U2_3 on Bottom Layer: 36.58,56.77 39.75,56.77 40.13,57.15 40.13,58.04 40.39,58.29 42.29,58.29 42.42,58.17 42.42,53.09 42.16,52.83 36.83,52.83 36.45,53.21 36.45,56.52
$1N47 on Top Layer: 42.29,53.21 41.91,52.83 36.96,52.83 36.58,53.21 36.58,56.52 36.7,56.64 39.75,56.64 40.13,57.02 40.13,58.04 40.39,58.29 42.16,58.29 42.42,58.04 42.42,56.26 42.29,56.13

## Text on the board
Bottom Layer: +12V | 4
Bottom Solder Mask Layer: +12V
Top Layer: +12V | BLUETOOTH | 1
Top Solder Mask Layer: +12V
Top Silkscreen Layer: NC | 12V | GND | R1.0 | 艾Sort
Inner1: 2
Inner2: 3
